# Altium project RMRC V0.1.PrjPcb (part 1 of 2)
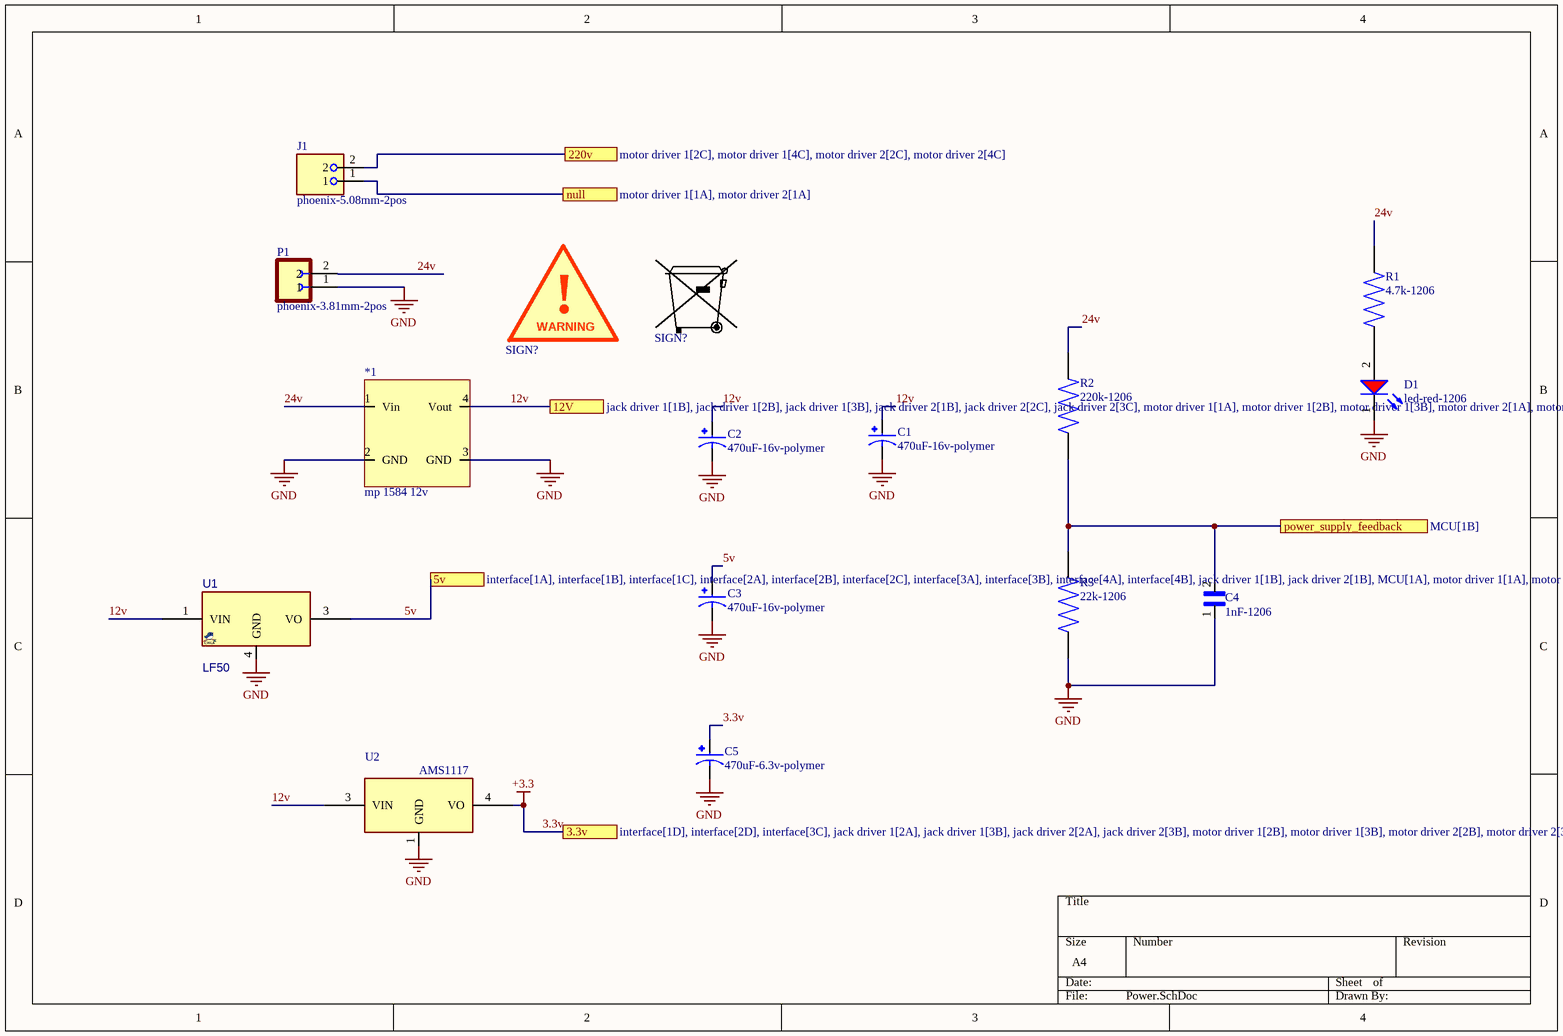
[diagram p0: Power.SchDoc]
9 sheets, 265 parts. Net scope: flat (ports and power ports of the same name join across sheets).
Board files: PCB1.PcbDoc, PCB2.PcbDoc, PCB3.PcbDoc, PCB4.PcbDoc
Sheets:
  Power.SchDoc
  MCU.SchDoc
  receiver 1.SchDoc
  receiver 2.SchDoc
  motor driver 1.SchDoc
  motor driver 2.SchDoc
  jack driver 1.SchDoc
  jack driver 2.SchDoc
  interface.SchDoc

## Sheet Power.SchDoc
size A4; SheetNumber: 1; SheetTotal: 9; SPICEModelCacheXSTPFURH: <root> / <DocumentId>XSTPFURH</DocumentId> / <CacheFrame Number="0"> / <Model Name="1206_156120rs82500" Kind="CKT"> / <Text>****** / .subckt 1206_156120RS82500  1  2 / D1 1 2 SMRW / .MODEL SMRW D / + IS=404.38E-18 / + N=2.1466 / + RS=.75545 / + IKF=193.03E-6 / + CJO=1.0000E-12 / + M=.3333 / + VJ=.75 / + BV=5 / + IBV=100.00E-6 / + TT=5.0000E-9 / .ends</Text> / </Model> / </CacheFrame> / </root>

### Parts
(Parts that share a designator on the sheet are numbered #1, #2 ... from top to bottom, then left to right.)
*1  mp 1584 12v  [PCBComponent_1]
C1  470uF-16v-polymer  [CAP_EEEFN1H101L]
C2  470uF-16v-polymer  [CAP_EEEFN1H101L]
C3  470uF-16v-polymer  [CAP_EEEFN1H101L]
C4  1nF-1206  [CAPC3216X180N]
C5  470uF-6.3v-polymer  [CAP_EEEFN1H101L]
D1  led-red-1206  [WL-SMRW_1206 dome_normal use]
J1  phoenix-5.08mm-2pos  [PHOENIX_1715721]
P1  phoenix-3.81mm-2pos  [PHOENIX_1803578]
R1  4.7k-1206  [RESC3015X65N]
R2  220k-1206  [RESC3015X65N]
R3  22k-1206  [RESC3015X65N]
SIGN?#1  Recycle-bin  [SIGN_RECBIN1]  (value not drawn)  (graphical)
SIGN?#2  WARNING  [SIGN_WARNING]  (value not drawn)  (graphical)
U1  LF50  [DPAK_3]
U2  AMS1117  [DPAK_3]  (value not drawn)

### Ports
3.3v (see interface[1D], interface[2D], interface[3C], jack driver 1[2A], jack driver 1[3B], jack driver 2[2A], jack driver 2[3B], motor driver 1[2B], motor driver 1[3B], motor driver 2[2B], motor driver 2[3B], receiver 1[2A], receiver 1[2C], receiver 1[4A], receiver 1[4C], receiver 2[2A], receiver 2[2C], receiver 2[4A], receiver 2[4C]), 5v (see interface[1A], interface[1B], interface[1C], interface[2A], interface[2B], interface[2C], interface[3A], interface[3B], interface[4A], interface[4B], jack driver 1[1B], jack driver 2[1B], MCU[1A], motor driver 1[1A], motor driver 2[1A]), 12V (see jack driver 1[1B], jack driver 1[2B], jack driver 1[3B], jack driver 2[1B], jack driver 2[2C], jack driver 2[3C], motor driver 1[1A], motor driver 1[2B], motor driver 1[3B], motor driver 2[1A], motor driver 2[2B], motor driver 2[3B]), 220v (see motor driver 1[2C], motor driver 1[4C], motor driver 2[2C], motor driver 2[4C]), null (see motor driver 1[1A], motor driver 2[1A]), power_supply_feedback (see MCU[1B])

### Nets
3.3v: C5.1 U2.4(VO) ; port 3.3v  [also labelled +3.3]
GND: *1.2(GND) *1.3(GND) C1.2 C2.2 C3.2 C4.1 C5.2 D1.1(K) P1.1 R3.1 U1.4(GND) U2.1(GND)
5v: C3.1 U1.3(VO) ; port 5v
12v: *1.4(Vout) C1.1 C2.1 U1.1(VIN) U2.3(VIN) ; port 12V
24v: *1.1(Vin) P1.2 R1.2 R2.2
NetC4_2: C4.2 R2.1 R3.2 ; port power_supply_feedback
NetD1_2: D1.2(A) R1.1
NetJ1_1: J1.1 ; port null
NetJ1_2: J1.2 ; port 220v

### Notes on the sheet
- (in symbol SIGN_WARNING) !

### Library data of the parts
*1 = Component_1
C1-C3 C5 = EEEFN1H101L: CAP ALUM 100UF 20% 50V SMD; MF: Panasonic; SnapEDA_Link: https://www.snapeda.com/parts/EEEFN1H101L/Panasonic/view-part/?ref=snap; Package: RADIAL-2 Panasonic; Value: *; MP: EEEFN1H101L; Check_prices: https://www.snapeda.com/parts/EEEFN1H101L/Panasonic/view-part/?ref=eda
C4 = CGA5L3X8R1H105M160AB: 1ÂµF Â±20% 50V Ceramic Capacitor X8R 1206 (3216 Metric); MF: TDK; Value: *; Purchase-URL: https://pricing.snapeda.com/search/part/CGA5L3X8R1H105M160AB/?ref=eda; Package: 3216 TDK; Availability: In Stock; SnapEDA_Link: https://www.snapeda.com/parts/CGA5L3X8R1H105M160AB/TDK/view-part/?ref=snap; MP: CGA5L3X8R1H105M160AB; Check_prices: https://www.snapeda.com/parts/CGA5L3X8R1H105M160AB/TDK/view-part/?ref=eda; Price: None
D1 = 156120RS82500: WL-SMRW Mono-color Reverse mount Waterclear, SMT, size 1206 dome, Red, 2V, 20°; Manufacturer: Wurth Elektronik; Chip Technology: AlInGaP; Dominant Wavelength: 624nm; Luminous Intensity: 1100mcd; Peak Wavelength: 632nm; Manufacturer Part Number: 156120RS82500; Category: Signal LEDs; Match Code: WL-SMRW; ComponentLink1Description: Website Link; ComponentLink1URL: https://www.we-online.com/redexpert/article/156120RS82500?ad; ComponentLink2Description: Datasheet Link; ComponentLink2URL: https://www.we-online.com/redexpert/spec/156120RS82500?ad; Mount: Surface Mount; Operating Temperature Max: 85°C; Operating Temperature Min: -40°C; Packaging: Tape and Reel; Case/Size Code: 1206 dome; Length: 3.2mm; Width: 1.6mm; Height: 1.85mm; Emitting Color: Red; Forward Voltage: 2V; Viewing Angle: 20°
J1 = 1715721: Package: None; Price: None; Value: *; MP: 1715721; Availability: Unavailable
P1 = 1803578: 2 Position Terminal Block Plug, Female Sockets 0.150 (3.81mm) 180Â° Free Hanging (In-Line); MF: Phoenix Contact; Price: None; Purchase-URL: https://pricing.snapeda.com/search/part/1803578/?ref=eda; Availability: Good; SnapEDA_Link: https://www.snapeda.com/parts/1803578/Phoenix%20Contact/view-part/46882/?ref=snap; MP: 1803578; Value: *; Check_prices: https://www.snapeda.com/parts/1803578/Phoenix%20Contact/view-part/46882/?ref=eda; Package: Custom Package Phoenix Contact
R1-R3 = CPF1206B10KE1: Res Thin Film 1206 10K Ohm 0.1% 1/8W Â±25ppm/Â°C Molded SMD SMD Paper T/R; Power_Rating: .125 W; MF: TE Connectivity; Voltage_Rating: 150 V; Tolerance: .1%; SnapEDA_Link: https://www.snapeda.com/parts/CPF1206B10KE1/TE+Connectivity/view-part/?ref=snap; Package: 1206; Resistance: 10K; Value: *; MP: CPF1206B10KE1; EU_RoHS_Compliance: Compliant; Check_prices: https://www.snapeda.com/parts/CPF1206B10KE1/TE+Connectivity/view-part/?ref=eda
SIGN?#1 = SIGN_RECBIN1: SIGN, Recycle-bin, 6x5mm; ASSEMBLY: DNP; VALUE: Recycle-bin
SIGN?#2 = SIGN_WARNING: SIGN, WARNING, 12X12mm; ASSEMBLY: DNP; VALUE: WARNING
U1 = VREG_LFXX_TO252: REG, Linear, LDO0.45V, 0.5A, TO-252; MANF_P#: LF33CDT; MANF: ST; PARAM: LDO0.45V, 0.5A,  82dB@120Hz; PARAM2: 1.5/1.8/2.5/3.3/5V; PRICE: 1500t; VALUE: LF50
U2 = VREG_AMS1117_DPACK3

## Sheet MCU.SchDoc
size A4; SheetNumber: 2; SheetTotal: 9
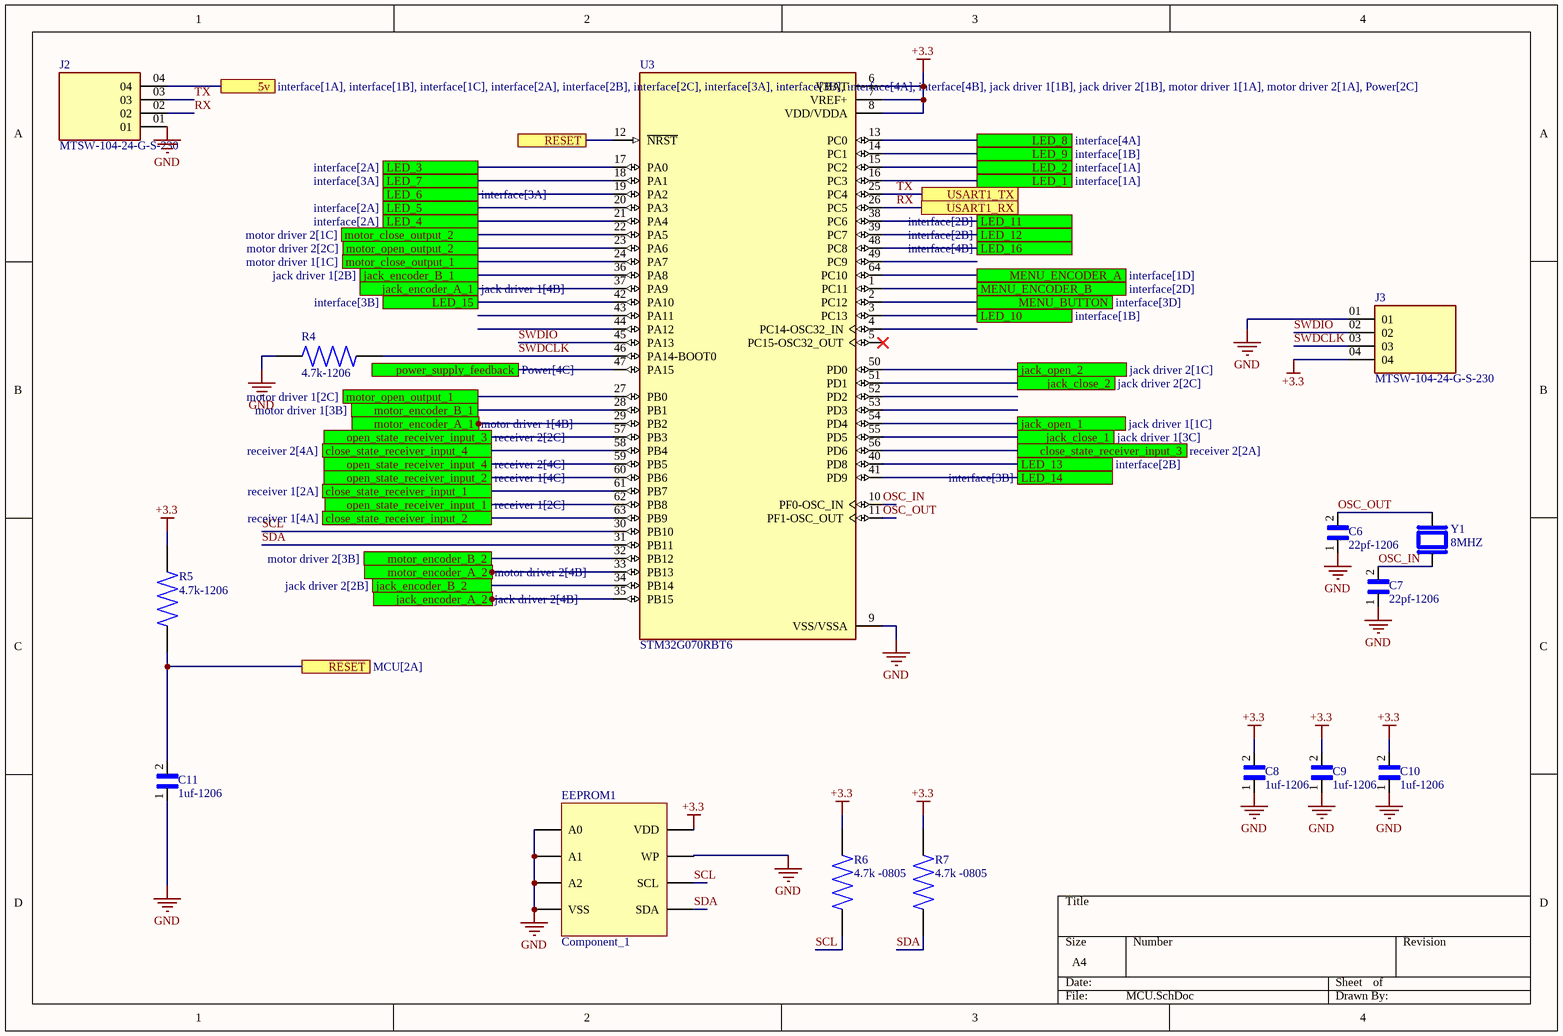
[diagram p1: MCU.SchDoc]

### Parts
C6  22pf-1206  [CAPC3216X180N]
C7  22pf-1206  [CAPC3216X180N]
C8  1uf-1206  [CAPC3216X180N]
C9  1uf-1206  [CAPC3216X180N]
C10  1uf-1206  [CAPC3216X180N]
C11  1uf-1206  [CAPC3216X180N]
EEPROM1  Component_1  [SOIC127P602X172-8N]
J2  MTSW-104-24-G-S-230  [SAMTEC_MTSW-104-24-G-S-230]
J3  MTSW-104-24-G-S-230  [SAMTEC_MTSW-104-24-G-S-230]
R4  4.7k-1206  [RESC3015X65N]
R5  4.7k-1206  [RESC3015X65N]
R6  4.7k -0805  [RESC2012X65N]
R7  4.7k -0805  [RESC2012X65N]
U3  STM32G070RBT6  [QFP50P1200X1200X160-64N]
Y1  8MHZ  [XTAL_ABLS2-12.000MHZ-D4Y-T]

### Ports
5v (see interface[1A], interface[1B], interface[1C], interface[2A], interface[2B], interface[2C], interface[3A], interface[3B], interface[4A], interface[4B], jack driver 1[1B], jack driver 2[1B], motor driver 1[1A], motor driver 2[1A], Power[2C]), close_state_receiver_input_1 (see receiver 1[2A]), close_state_receiver_input_2 (see receiver 1[4A]), close_state_receiver_input_3 (see receiver 2[2A]), close_state_receiver_input_4 (see receiver 2[4A]), jack_close_1 (see jack driver 1[3C]), jack_close_2 (see jack driver 2[2C]), jack_encoder_A_1 (see jack driver 1[4B]), jack_encoder_A_2 (see jack driver 2[4B]), jack_encoder_B_1 (see jack driver 1[2B]), jack_encoder_B_2 (see jack driver 2[2B]), jack_open_1 (see jack driver 1[1C]), jack_open_2 (see jack driver 2[1C]), LED_1 (see interface[1A]), LED_2 (see interface[1A]), LED_3 (see interface[2A]), LED_4 (see interface[2A]), LED_5 (see interface[2A]), LED_6 (see interface[3A]), LED_7 (see interface[3A]), LED_8 (see interface[4A]), LED_9 (see interface[1B]), LED_10 (see interface[1B]), LED_11 (see interface[2B]), LED_12 (see interface[2B]), LED_13 (see interface[2B]), LED_14 (see interface[3B]), LED_15 (see interface[3B]), LED_16 (see interface[4B]), MENU_BUTTON (see interface[3D]), MENU_ENCODER_A (see interface[1D]), MENU_ENCODER_B (see interface[2D]), motor_close_output_1 (see motor driver 1[1C]), motor_close_output_2 (see motor driver 2[1C]), motor_encoder_A_1 (see motor driver 1[4B]), motor_encoder_A_2 (see motor driver 2[4B]), motor_encoder_B_1 (see motor driver 1[3B]), motor_encoder_B_2 (see motor driver 2[3B]), motor_open_output_1 (see motor driver 1[2C]), motor_open_output_2 (see motor driver 2[2C]), open_state_receiver_input_1 (see receiver 1[2C]), open_state_receiver_input_2 (see receiver 1[4C]), open_state_receiver_input_3 (see receiver 2[2C]), open_state_receiver_input_4 (see receiver 2[4C]), power_supply_feedback (see Power[4C]), RESET (see MCU[1C]), RESET (see MCU[2A]), USART1_RX, USART1_TX

### Nets
+3.3: C8.2 C9.2 C10.2 EEPROM1.7(VDD) J3.04 R5.2 R6.2 R7.2 U3.6(VBAT) U3.7(VREF+) U3.8(VDD/VDDA)  [project net 3.3v]
GND: C6.1 C7.1 C8.1 C9.1 C10.1 C11.1 EEPROM1.0(A0) EEPROM1.1(A1) EEPROM1.2(A2) EEPROM1.3(VSS) EEPROM1.6(WP) J2.01 J3.01 R4.2 U3.9(VSS/VSSA)
5v: J2.04 ; port 5v
OSC_IN: C7.2 U3.10(PF0-OSC_IN) Y1.1
OSC_OUT: C6.2 U3.11(PF1-OSC_OUT) Y1.2
RX: J2.02 U3.26(PC5) ; port USART1_RX
SCL: EEPROM1.5(SCL) R6.1 U3.30(PB10)
SDA: EEPROM1.4(SDA) R7.1 U3.31(PB11)
SWDCLK: J3.03 R4.1 U3.46(PA14-BOOT0)
SWDIO: J3.02 U3.45(PA13)
TX: J2.03 U3.25(PC4) ; port USART1_TX
NetC4_2: U3.47(PA15) ; port power_supply_feedback
NetC11_2: C11.2 R5.1 U3.12(~{NRST}) ; port RESET
NetC12_2: U3.37(PA9) ; port jack_encoder_A_1
NetC14_2: U3.29(PB2) ; port motor_encoder_A_1
NetC15_2: U3.2(PC12) ; port MENU_BUTTON
NetC16_2: U3.64(PC10) ; port MENU_ENCODER_A
NetC17_2: U3.61(PB7) ; port close_state_receiver_input_1
NetC18_2: U3.63(PB9) ; port close_state_receiver_input_2
NetC19_2: U3.62(PB8) ; port open_state_receiver_input_1
NetC20_2: U3.60(PB6) ; port open_state_receiver_input_2
NetC21_2: U3.56(PD6) ; port close_state_receiver_input_3
NetC22_2: U3.58(PB4) ; port close_state_receiver_input_4
NetC23_2: U3.57(PB3) ; port open_state_receiver_input_3
NetC24_2: U3.59(PB5) ; port open_state_receiver_input_4
NetC25_2: U3.35(PB15) ; port jack_encoder_A_2
NetC27_2: U3.33(PB13) ; port motor_encoder_A_2
NetQ1_2: U3.36(PA8) ; port jack_encoder_B_1
NetQ5_2: U3.28(PB1) ; port motor_encoder_B_1
NetQ26_2: U3.1(PC11) ; port MENU_ENCODER_B
NetQ27_2: U3.34(PB14) ; port jack_encoder_B_2
NetQ31_2: U3.32(PB12) ; port motor_encoder_B_2
NetR12_2: U3.54(PD4) ; port jack_open_1
NetR13_2: U3.55(PD5) ; port jack_close_1
NetR18_2: U3.24(PA7) ; port motor_close_output_1
NetR19_2: U3.27(PB0) ; port motor_open_output_1
NetR28_2: U3.16(PC3) ; port LED_1
NetR29_2: U3.15(PC2) ; port LED_2
NetR30_2: U3.17(PA0) ; port LED_3
NetR31_2: U3.21(PA4) ; port LED_4
NetR32_2: U3.20(PA3) ; port LED_5
NetR33_2: U3.19(PA2) ; port LED_6
NetR34_2: U3.18(PA1) ; port LED_7
NetR35_2: U3.13(PC0) ; port LED_8
NetR44_2: U3.14(PC1) ; port LED_9
NetR45_2: U3.3(PC13) ; port LED_10
NetR46_2: U3.38(PC6) ; port LED_11
NetR47_2: U3.39(PC7) ; port LED_12
NetR48_2: U3.40(PD8) ; port LED_13
NetR49_2: U3.41(PD9) ; port LED_14
NetR50_2: U3.42(PA10) ; port LED_15
NetR51_2: U3.48(PC8) ; port LED_16
NetR109_2: U3.50(PD0) ; port jack_open_2
NetR110_2: U3.51(PD1) ; port jack_close_2
NetR115_2: U3.22(PA5) ; port motor_close_output_2
NetR116_2: U3.23(PA6) ; port motor_open_output_2

Not connected (* = marked no-connect by the designer): U3 4(PC14-OSC32_IN) 5(PC15-OSC32_OUT)* 43(PA11) 44(PA12) 49(PC9) 52(PD2) 53(PD3)

### Library data of the parts
C6-C11 = CGA5L3X8R1H105M160AB: as C4 on sheet Power; Value: *; Purchase-URL: https://pricing.snapeda.com/search/part/CGA5L3X8R1H105M160AB/?ref=eda; Package: 3216 TDK; Availability: In Stock; SnapEDA_Link: https://www.snapeda.com/parts/CGA5L3X8R1H105M160AB/TDK/view-part/?ref=snap; MP: CGA5L3X8R1H105M160AB; Check_prices: https://www.snapeda.com/parts/CGA5L3X8R1H105M160AB/TDK/view-part/?ref=eda; Price: None
R4 R5 = CPF1206B10KE1: as R1 on sheet Power; SnapEDA_Link: https://www.snapeda.com/parts/CPF1206B10KE1/TE+Connectivity/view-part/?ref=snap; Package: 1206; Resistance: 10K; Value: *; MP: CPF1206B10KE1; EU_RoHS_Compliance: Compliant; Check_prices: https://www.snapeda.com/parts/CPF1206B10KE1/TE+Connectivity/view-part/?ref=eda
R6 R7 = CRGCQ0805J470R: Fixed Resistor CRGCQ 0805 470R 5%; MF: TE Connectivity; SnapEDA_Link: https://www.snapeda.com/parts/CRGCQ0805J470R/TE+Connectivity/view-part/?ref=snap; Package: 2012 TE Connectivity; Value: *; MP: CRGCQ0805J470R; Check_prices: https://www.snapeda.com/parts/CRGCQ0805J470R/TE+Connectivity/view-part/?ref=eda
U3 = STM32G070RBT6: ARMÂ® CortexÂ®-M0+ STM32G0 Microcontroller IC 32-Bit Single-Core 64MHz 128KB (128K x 8) FLASH 64-LQFP (10x10); MF: STMicroelectronics; SnapEDA_Link: https://www.snapeda.com/parts/STM32G070RBT6/STMicroelectronics/view-part/?ref=snap; Package: LQFP-64 STMicroelectronics; Value: *; MP: STM32G070RBT6; Check_prices: https://www.snapeda.com/parts/STM32G070RBT6/STMicroelectronics/view-part/?ref=eda
Y1 = ABLS2-12.000MHZ-D4Y-T: HC/49US (AT49) LOW PROFILE SURFACE MOUNT MICROPROCESSOR CRYSTAL; MF: Abracon; Purchase-URL: https://pricing.snapeda.com/search/part/ABLS2-12.000MHZ-D4Y-T/?ref=eda; Package: HC49/US Abracon; MP: ABLS2-12.000MHZ-D4Y-T; Value: *; Price: None; Availability: In Stock; SnapEDA_Link: https://www.snapeda.com/parts/ABLS2-12.000MHZ-D4Y-T/Abracon+LLC/view-part/?ref=snap; Check_prices: https://www.snapeda.com/parts/ABLS2-12.000MHZ-D4Y-T/Abracon+LLC/view-part/?ref=eda
J2 J3 = MTSW-104-24-G-S-230: Price: None; Value: *; Package: None; Availability: Unavailable; MP: MTSW-104-24-G-S-230

## Sheet receiver 1.SchDoc
size A4; SheetNumber: 3; SheetTotal: 9; SPICEModelCacheALZHYQGP: <root> / <DocumentId>ALZHYQGP</DocumentId> / <CacheFrame Number="0"> / <Model Name="1206_156120rs82500" Kind="CKT"> / <Text>****** / .subckt 1206_156120RS82500  1  2 / D1 1 2 SMRW / .MODEL SMRW D / + IS=404.38E-18 / + N=2.1466 / + RS=.75545 / + IKF=193.03E-6 / + CJO=1.0000E-12 / + M=.3333 / + VJ=.75 / + BV=5 / + IBV=100.00E-6 / + TT=5.0000E-9 / .ends</Text> / </Model> / </CacheFrame> / </root>
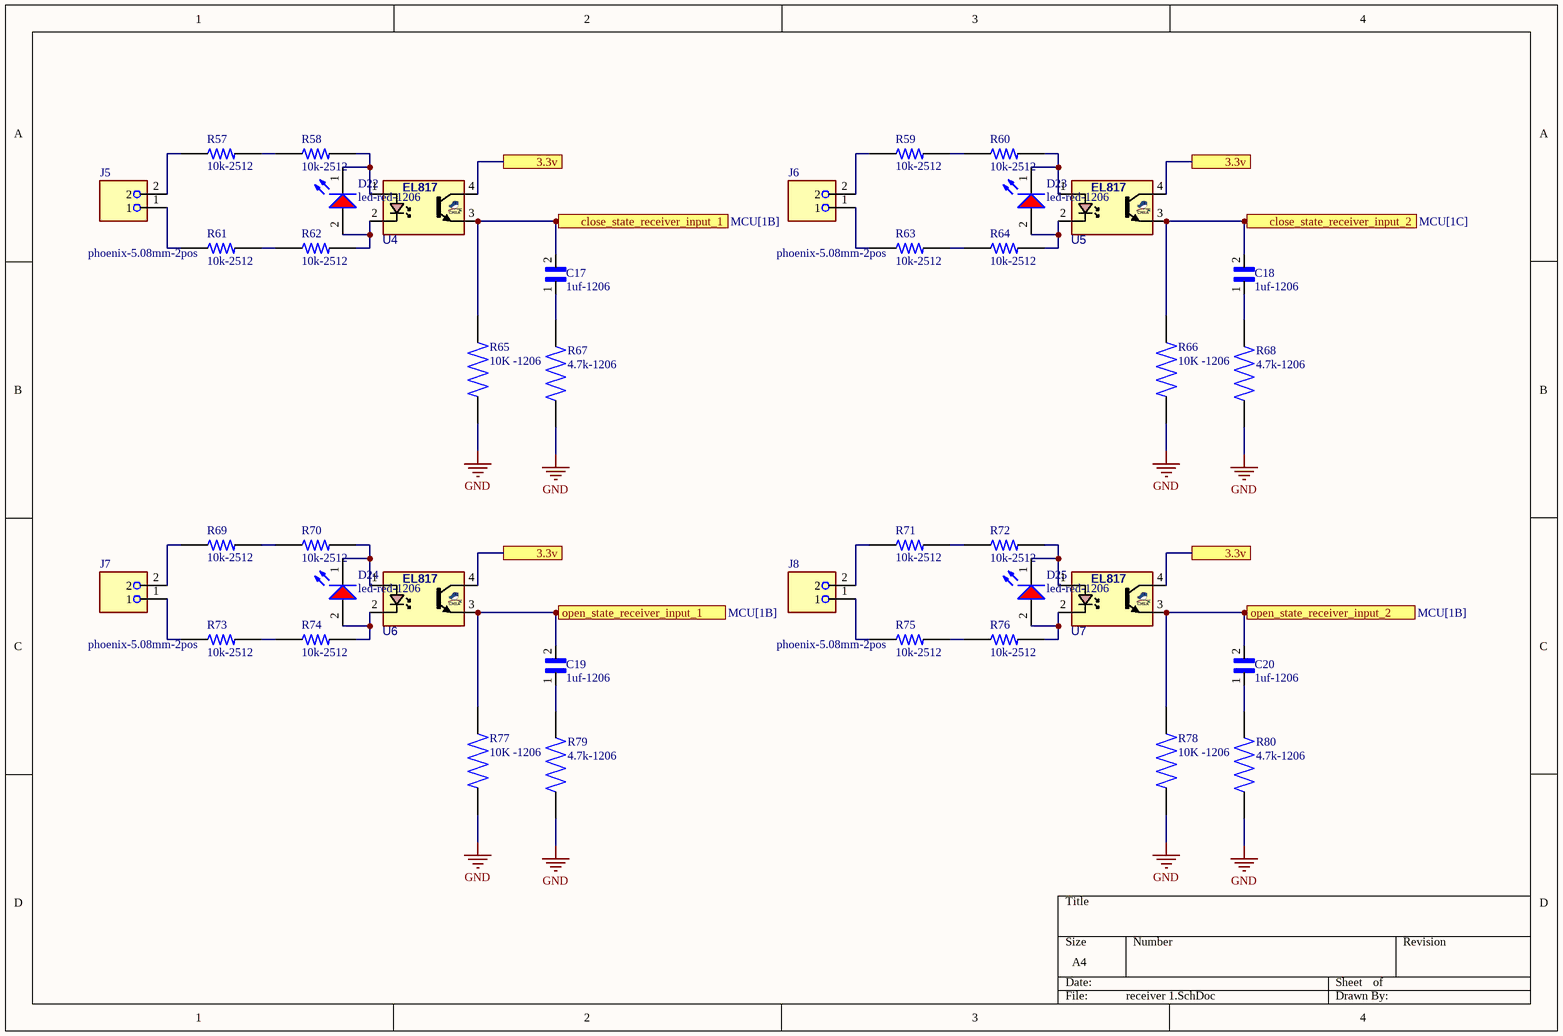
[diagram p2: receiver 1.SchDoc]

### Parts
C17  1uf-1206  [CAPC3216X180N]
C18  1uf-1206  [CAPC3216X180N]
C19  1uf-1206  [CAPC3216X180N]
C20  1uf-1206  [CAPC3216X180N]
D22  led-red-1206  [WL-SMRW_1206 dome_normal use]
D23  led-red-1206  [WL-SMRW_1206 dome_normal use]
D24  led-red-1206  [WL-SMRW_1206 dome_normal use]
D25  led-red-1206  [WL-SMRW_1206 dome_normal use]
J5  phoenix-5.08mm-2pos  [PHOENIX_1715721]
J6  phoenix-5.08mm-2pos  [PHOENIX_1715721]
J7  phoenix-5.08mm-2pos  [PHOENIX_1715721]
J8  phoenix-5.08mm-2pos  [PHOENIX_1715721]
R57  10k-2512  [RESC6331X70N]
R58  10k-2512  [RESC6331X70N]
R59  10k-2512  [RESC6331X70N]
R60  10k-2512  [RESC6331X70N]
R61  10k-2512  [RESC6331X70N]
R62  10k-2512  [RESC6331X70N]
R63  10k-2512  [RESC6331X70N]
R64  10k-2512  [RESC6331X70N]
R65  10K -1206  [RESC3015X65N]
R66  10K -1206  [RESC3015X65N]
R67  4.7k-1206  [RESC3015X65N]
R68  4.7k-1206  [RESC3015X65N]
R69  10k-2512  [RESC6331X70N]
R70  10k-2512  [RESC6331X70N]
R71  10k-2512  [RESC6331X70N]
R72  10k-2512  [RESC6331X70N]
R73  10k-2512  [RESC6331X70N]
R74  10k-2512  [RESC6331X70N]
R75  10k-2512  [RESC6331X70N]
R76  10k-2512  [RESC6331X70N]
R77  10K -1206  [RESC3015X65N]
R78  10K -1206  [RESC3015X65N]
R79  4.7k-1206  [RESC3015X65N]
R80  4.7k-1206  [RESC3015X65N]
U4  EL817  [DIP_4SMD]  (value not drawn)
U5  EL817  [DIP_4SMD]  (value not drawn)
U6  EL817  [DIP_4SMD]  (value not drawn)
U7  EL817  [DIP_4SMD]  (value not drawn)

### Ports
3.3v (see interface[1D], interface[2D], interface[3C], jack driver 1[2A], jack driver 1[3B], jack driver 2[2A], jack driver 2[3B], motor driver 1[2B], motor driver 1[3B], motor driver 2[2B], motor driver 2[3B], Power[2D], receiver 1[2A], receiver 1[2C], receiver 1[4A], receiver 2[2A], receiver 2[2C], receiver 2[4A], receiver 2[4C]), 3.3v (see interface[1D], interface[2D], interface[3C], jack driver 1[2A], jack driver 1[3B], jack driver 2[2A], jack driver 2[3B], motor driver 1[2B], motor driver 1[3B], motor driver 2[2B], motor driver 2[3B], Power[2D], receiver 1[2A], receiver 1[2C], receiver 1[4C], receiver 2[2A], receiver 2[2C], receiver 2[4A], receiver 2[4C]), 3.3v (see interface[1D], interface[2D], interface[3C], jack driver 1[2A], jack driver 1[3B], jack driver 2[2A], jack driver 2[3B], motor driver 1[2B], motor driver 1[3B], motor driver 2[2B], motor driver 2[3B], Power[2D], receiver 1[2A], receiver 1[4A], receiver 1[4C], receiver 2[2A], receiver 2[2C], receiver 2[4A], receiver 2[4C]), 3.3v (see interface[1D], interface[2D], interface[3C], jack driver 1[2A], jack driver 1[3B], jack driver 2[2A], jack driver 2[3B], motor driver 1[2B], motor driver 1[3B], motor driver 2[2B], motor driver 2[3B], Power[2D], receiver 1[2C], receiver 1[4A], receiver 1[4C], receiver 2[2A], receiver 2[2C], receiver 2[4A], receiver 2[4C]), close_state_receiver_input_1 (see MCU[1B]), close_state_receiver_input_2 (see MCU[1C]), open_state_receiver_input_1 (see MCU[1B]), open_state_receiver_input_2 (see MCU[1B])

### Nets
3.3v: U4.4(C) U5.4(C) U6.4(C) U7.4(C) ; port 3.3v
GND: R65.1 R66.1 R67.1 R68.1 R77.1 R78.1 R79.1 R80.1
NetC17_1: C17.1 R67.2
NetC17_2: C17.2 R65.2 U4.3(E) ; port close_state_receiver_input_1
NetC18_1: C18.1 R68.2
NetC18_2: C18.2 R66.2 U5.3(E) ; port close_state_receiver_input_2
NetC19_1: C19.1 R79.2
NetC19_2: C19.2 R77.2 U6.3(E) ; port open_state_receiver_input_1
NetC20_1: C20.1 R80.2
NetC20_2: C20.2 R78.2 U7.3(E) ; port open_state_receiver_input_2
NetD22_1: D22.1(K) R58.2 U4.1(A)
NetD22_2: D22.2(A) R62.2 U4.2(K)
NetD23_1: D23.1(K) R60.2 U5.1(A)
NetD23_2: D23.2(A) R64.2 U5.2(K)
NetD24_1: D24.1(K) R70.2 U6.1(A)
NetD24_2: D24.2(A) R74.2 U6.2(K)
NetD25_1: D25.1(K) R72.2 U7.1(A)
NetD25_2: D25.2(A) R76.2 U7.2(K)
NetJ5_1: J5.1 R61.1
NetJ5_2: J5.2 R57.1
NetJ6_1: J6.1 R63.1
NetJ6_2: J6.2 R59.1
NetJ7_1: J7.1 R73.1
NetJ7_2: J7.2 R69.1
NetJ8_1: J8.1 R75.1
NetJ8_2: J8.2 R71.1
NetR57_2: R57.2 R58.1
NetR59_2: R59.2 R60.1
NetR61_2: R61.2 R62.1
NetR63_2: R63.2 R64.1
NetR69_2: R69.2 R70.1
NetR71_2: R71.2 R72.1
NetR73_2: R73.2 R74.1
NetR75_2: R75.2 R76.1

### Library data of the parts
C17-C20 = CGA5L3X8R1H105M160AB: as C4 on sheet Power; Value: *; Purchase-URL: https://pricing.snapeda.com/search/part/CGA5L3X8R1H105M160AB/?ref=eda; Package: 3216 TDK; Availability: In Stock; SnapEDA_Link: https://www.snapeda.com/parts/CGA5L3X8R1H105M160AB/TDK/view-part/?ref=snap; MP: CGA5L3X8R1H105M160AB; Check_prices: https://www.snapeda.com/parts/CGA5L3X8R1H105M160AB/TDK/view-part/?ref=eda; Price: None
D22-D25 = 156120RS82500: as D1 on sheet Power; Manufacturer Part Number: 156120RS82500; Category: Signal LEDs; Match Code: WL-SMRW; ComponentLink1Description: Website Link; ComponentLink1URL: https://www.we-online.com/redexpert/article/156120RS82500?ad; ComponentLink2Description: Datasheet Link; ComponentLink2URL: https://www.we-online.com/redexpert/spec/156120RS82500?ad; Mount: Surface Mount; Operating Temperature Max: 85°C; Operating Temperature Min: -40°C; Packaging: Tape and Reel; Case/Size Code: 1206 dome; Length: 3.2mm; Width: 1.6mm; Height: 1.85mm; Emitting Color: Red; Forward Voltage: 2V; Viewing Angle: 20°
J5-J8 = 1715721: Package: None; Price: None; Value: *; MP: 1715721; Availability: Unavailable
R57-R64 R69-R76 = 5-2176246-2: 18 kOhms Â±5% 1.5W Chip Resistor 2512 (6432 Metric) Pulse Withstanding Thick Film; MF: TE Connectivity; SnapEDA_Link: https://www.snapeda.com/parts/5-2176246-2/TE+Connectivity+AMP+Connectors/view-part/?ref=snap; Package: None; Value: *; MP: 5-2176246-2; Check_prices: https://www.snapeda.com/parts/5-2176246-2/TE+Connectivity+AMP+Connectors/view-part/?ref=eda
R65-R68 R77-R80 = CPF1206B10KE1: as R1 on sheet Power; SnapEDA_Link: https://www.snapeda.com/parts/CPF1206B10KE1/TE+Connectivity/view-part/?ref=snap; Package: 1206; Resistance: 10K; Value: *; MP: CPF1206B10KE1; EU_RoHS_Compliance: Compliant; Check_prices: https://www.snapeda.com/parts/CPF1206B10KE1/TE+Connectivity/view-part/?ref=eda
U4-U7 = OPTC_TR4P_EL817_SMD: OPTOCOUPLER, TRANSISTOR, 4PIN; PARAM: IF=5mA; PARAM2: VCE = 5V; PRICE: 300t@Paya; VALUE: EL817; PACKAGE: DIP-4SMD

## Sheet receiver 2.SchDoc
size A4; SheetNumber: 4; SheetTotal: 9
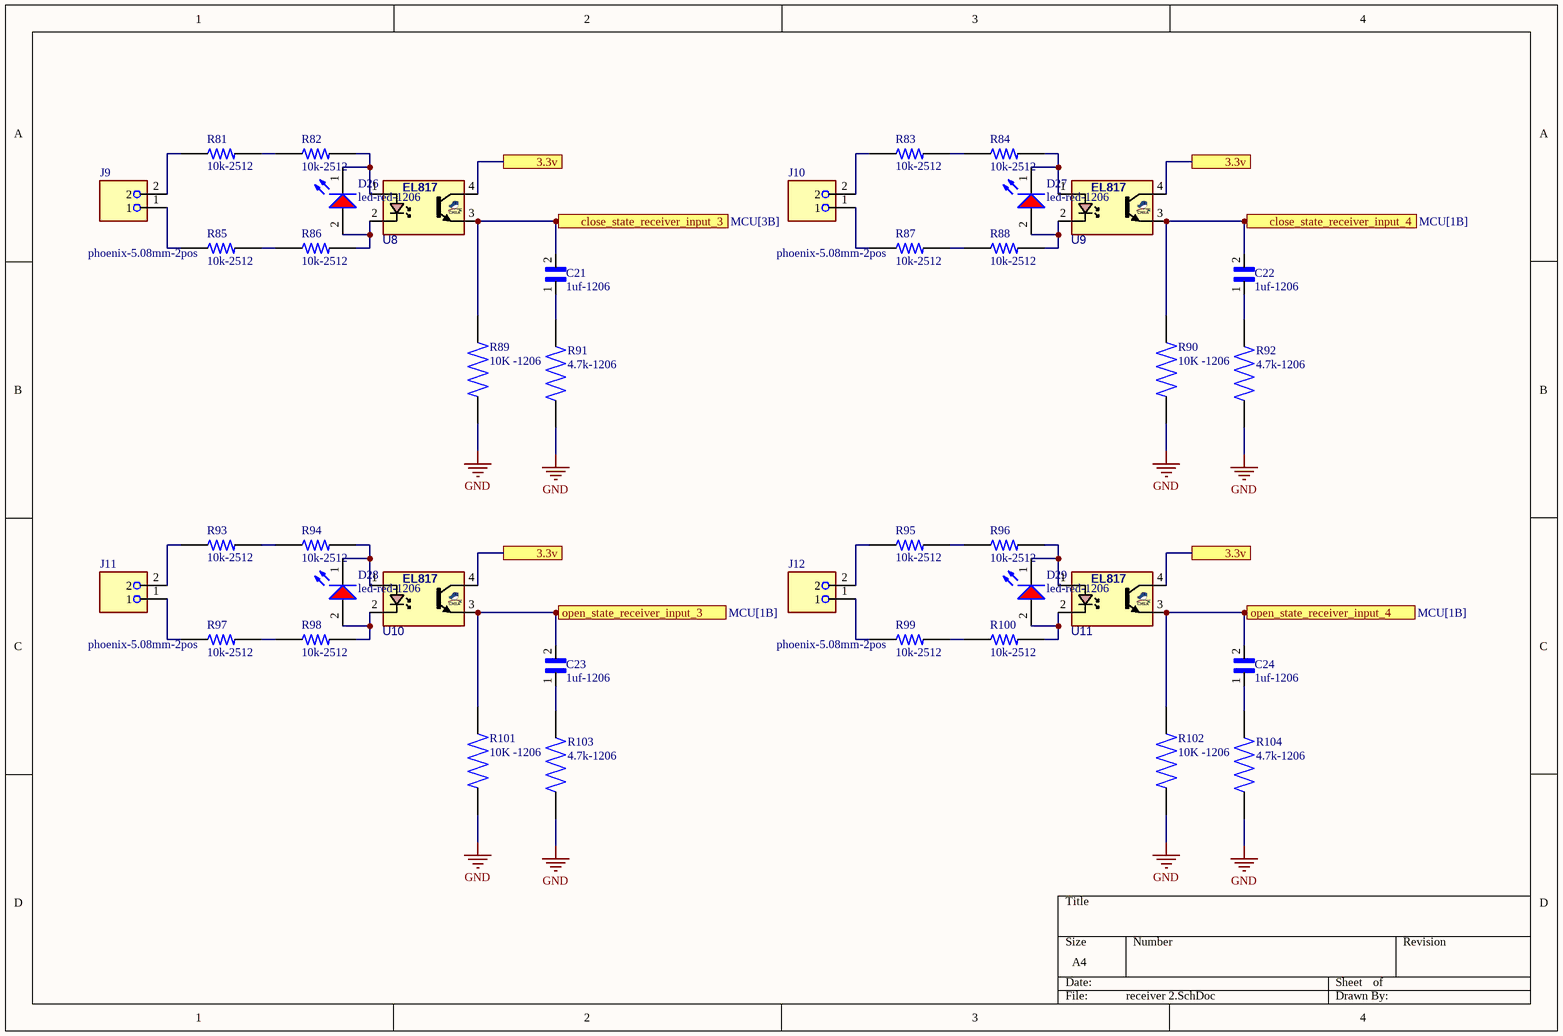
[diagram p3: receiver 2.SchDoc]

### Parts
C21  1uf-1206  [CAPC3216X180N]
C22  1uf-1206  [CAPC3216X180N]
C23  1uf-1206  [CAPC3216X180N]
C24  1uf-1206  [CAPC3216X180N]
D26  led-red-1206  [WL-SMRW_1206 dome_normal use]
D27  led-red-1206  [WL-SMRW_1206 dome_normal use]
D28  led-red-1206  [WL-SMRW_1206 dome_normal use]
D29  led-red-1206  [WL-SMRW_1206 dome_normal use]
J9  phoenix-5.08mm-2pos  [PHOENIX_1715721]
J10  phoenix-5.08mm-2pos  [PHOENIX_1715721]
J11  phoenix-5.08mm-2pos  [PHOENIX_1715721]
J12  phoenix-5.08mm-2pos  [PHOENIX_1715721]
R81  10k-2512  [RESC6331X70N]
R82  10k-2512  [RESC6331X70N]
R83  10k-2512  [RESC6331X70N]
R84  10k-2512  [RESC6331X70N]
R85  10k-2512  [RESC6331X70N]
R86  10k-2512  [RESC6331X70N]
R87  10k-2512  [RESC6331X70N]
R88  10k-2512  [RESC6331X70N]
R89  10K -1206  [RESC3015X65N]
R90  10K -1206  [RESC3015X65N]
R91  4.7k-1206  [RESC3015X65N]
R92  4.7k-1206  [RESC3015X65N]
R93  10k-2512  [RESC6331X70N]
R94  10k-2512  [RESC6331X70N]
R95  10k-2512  [RESC6331X70N]
R96  10k-2512  [RESC6331X70N]
R97  10k-2512  [RESC6331X70N]
R98  10k-2512  [RESC6331X70N]
R99  10k-2512  [RESC6331X70N]
R100  10k-2512  [RESC6331X70N]
R101  10K -1206  [RESC3015X65N]
R102  10K -1206  [RESC3015X65N]
R103  4.7k-1206  [RESC3015X65N]
R104  4.7k-1206  [RESC3015X65N]
U8  EL817  [DIP_4SMD]  (value not drawn)
U9  EL817  [DIP_4SMD]  (value not drawn)
U10  EL817  [DIP_4SMD]  (value not drawn)
U11  EL817  [DIP_4SMD]  (value not drawn)

### Ports
3.3v (see interface[1D], interface[2D], interface[3C], jack driver 1[2A], jack driver 1[3B], jack driver 2[2A], jack driver 2[3B], motor driver 1[2B], motor driver 1[3B], motor driver 2[2B], motor driver 2[3B], Power[2D], receiver 1[2A], receiver 1[2C], receiver 1[4A], receiver 1[4C], receiver 2[2A], receiver 2[2C], receiver 2[4A]), 3.3v (see interface[1D], interface[2D], interface[3C], jack driver 1[2A], jack driver 1[3B], jack driver 2[2A], jack driver 2[3B], motor driver 1[2B], motor driver 1[3B], motor driver 2[2B], motor driver 2[3B], Power[2D], receiver 1[2A], receiver 1[2C], receiver 1[4A], receiver 1[4C], receiver 2[2A], receiver 2[2C], receiver 2[4C]), 3.3v (see interface[1D], interface[2D], interface[3C], jack driver 1[2A], jack driver 1[3B], jack driver 2[2A], jack driver 2[3B], motor driver 1[2B], motor driver 1[3B], motor driver 2[2B], motor driver 2[3B], Power[2D], receiver 1[2A], receiver 1[2C], receiver 1[4A], receiver 1[4C], receiver 2[2A], receiver 2[4A], receiver 2[4C]), 3.3v (see interface[1D], interface[2D], interface[3C], jack driver 1[2A], jack driver 1[3B], jack driver 2[2A], jack driver 2[3B], motor driver 1[2B], motor driver 1[3B], motor driver 2[2B], motor driver 2[3B], Power[2D], receiver 1[2A], receiver 1[2C], receiver 1[4A], receiver 1[4C], receiver 2[2C], receiver 2[4A], receiver 2[4C]), close_state_receiver_input_3 (see MCU[3B]), close_state_receiver_input_4 (see MCU[1B]), open_state_receiver_input_3 (see MCU[1B]), open_state_receiver_input_4 (see MCU[1B])

### Nets
3.3v: U8.4(C) U9.4(C) U10.4(C) U11.4(C) ; port 3.3v
GND: R89.1 R90.1 R91.1 R92.1 R101.1 R102.1 R103.1 R104.1
NetC21_1: C21.1 R91.2
NetC21_2: C21.2 R89.2 U8.3(E) ; port close_state_receiver_input_3
NetC22_1: C22.1 R92.2
NetC22_2: C22.2 R90.2 U9.3(E) ; port close_state_receiver_input_4
NetC23_1: C23.1 R103.2
NetC23_2: C23.2 R101.2 U10.3(E) ; port open_state_receiver_input_3
NetC24_1: C24.1 R104.2
NetC24_2: C24.2 R102.2 U11.3(E) ; port open_state_receiver_input_4
NetD26_1: D26.1(K) R82.2 U8.1(A)
NetD26_2: D26.2(A) R86.2 U8.2(K)
NetD27_1: D27.1(K) R84.2 U9.1(A)
NetD27_2: D27.2(A) R88.2 U9.2(K)
NetD28_1: D28.1(K) R94.2 U10.1(A)
NetD28_2: D28.2(A) R98.2 U10.2(K)
NetD29_1: D29.1(K) R96.2 U11.1(A)
NetD29_2: D29.2(A) R100.2 U11.2(K)
NetJ9_1: J9.1 R85.1
NetJ9_2: J9.2 R81.1
NetJ10_1: J10.1 R87.1
NetJ10_2: J10.2 R83.1
NetJ11_1: J11.1 R97.1
NetJ11_2: J11.2 R93.1
NetJ12_1: J12.1 R99.1
NetJ12_2: J12.2 R95.1
NetR81_2: R81.2 R82.1
NetR83_2: R83.2 R84.1
NetR85_2: R85.2 R86.1
NetR87_2: R87.2 R88.1
NetR93_2: R93.2 R94.1
NetR95_2: R95.2 R96.1
NetR97_2: R97.2 R98.1
NetR99_2: R99.2 R100.1

### Library data of the parts
C21-C24 = CGA5L3X8R1H105M160AB: as C4 on sheet Power; Value: *; Purchase-URL: https://pricing.snapeda.com/search/part/CGA5L3X8R1H105M160AB/?ref=eda; Package: 3216 TDK; Availability: In Stock; SnapEDA_Link: https://www.snapeda.com/parts/CGA5L3X8R1H105M160AB/TDK/view-part/?ref=snap; MP: CGA5L3X8R1H105M160AB; Check_prices: https://www.snapeda.com/parts/CGA5L3X8R1H105M160AB/TDK/view-part/?ref=eda; Price: None
D26-D29 = 156120RS82500: as D1 on sheet Power; Manufacturer Part Number: 156120RS82500; Category: Signal LEDs; Match Code: WL-SMRW; ComponentLink1Description: Website Link; ComponentLink1URL: https://www.we-online.com/redexpert/article/156120RS82500?ad; ComponentLink2Description: Datasheet Link; ComponentLink2URL: https://www.we-online.com/redexpert/spec/156120RS82500?ad; Mount: Surface Mount; Operating Temperature Max: 85°C; Operating Temperature Min: -40°C; Packaging: Tape and Reel; Case/Size Code: 1206 dome; Length: 3.2mm; Width: 1.6mm; Height: 1.85mm; Emitting Color: Red; Forward Voltage: 2V; Viewing Angle: 20°
J9-J12 = 1715721: Package: None; Price: None; Value: *; MP: 1715721; Availability: Unavailable
R81-R88 R93-R100 = 5-2176246-2: as R57 on sheet receiver 1; SnapEDA_Link: https://www.snapeda.com/parts/5-2176246-2/TE+Connectivity+AMP+Connectors/view-part/?ref=snap; Package: None; Value: *; MP: 5-2176246-2; Check_prices: https://www.snapeda.com/parts/5-2176246-2/TE+Connectivity+AMP+Connectors/view-part/?ref=eda
R89-R92 R101-R104 = CPF1206B10KE1: as R1 on sheet Power; SnapEDA_Link: https://www.snapeda.com/parts/CPF1206B10KE1/TE+Connectivity/view-part/?ref=snap; Package: 1206; Resistance: 10K; Value: *; MP: CPF1206B10KE1; EU_RoHS_Compliance: Compliant; Check_prices: https://www.snapeda.com/parts/CPF1206B10KE1/TE+Connectivity/view-part/?ref=eda
U8-U11 = OPTC_TR4P_EL817_SMD: as U4 on sheet receiver 1; PRICE: 300t@Paya; VALUE: EL817; PACKAGE: DIP-4SMD

## Sheet motor driver 1.SchDoc
size A4; SheetNumber: 5; SheetTotal: 9
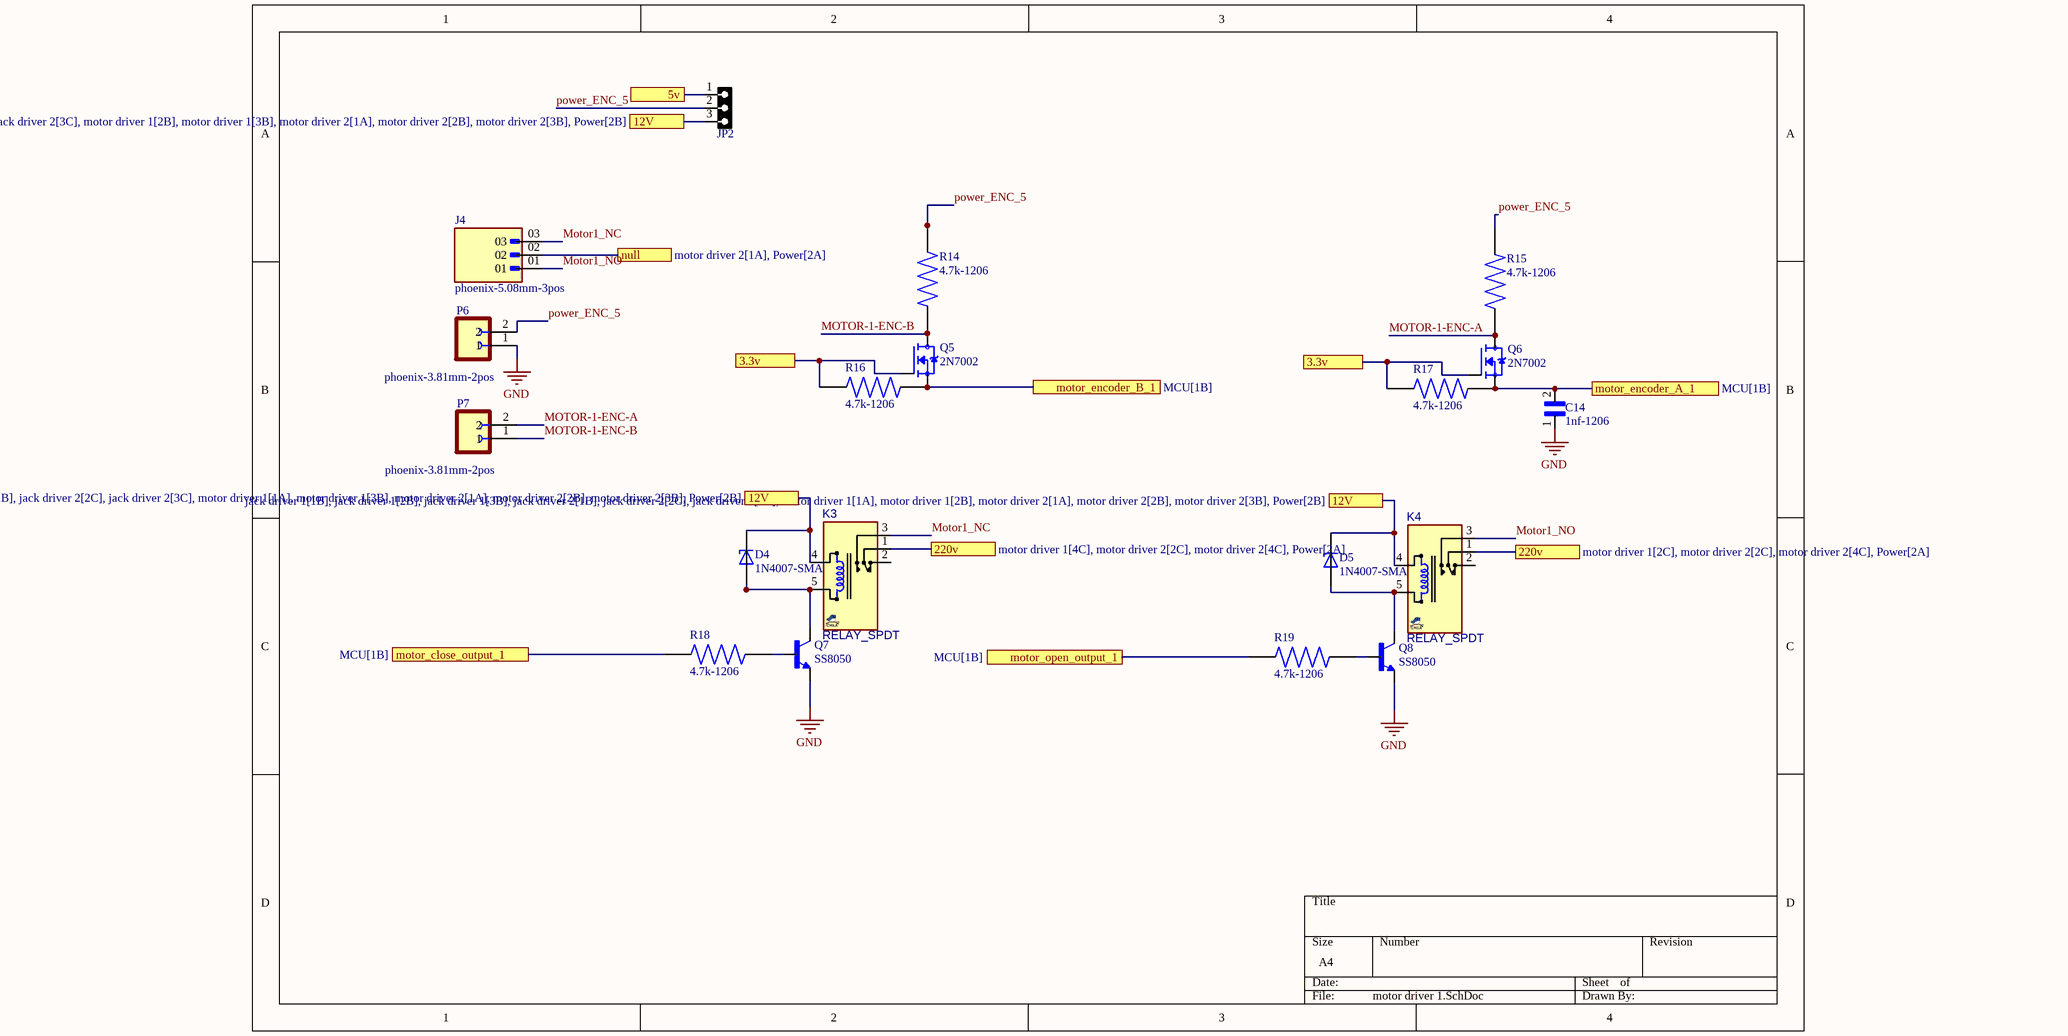
[diagram p4: motor driver 1.SchDoc]

### Parts
C14  1nf-1206  [CAPC3216X180N]
D4  1N4007-SMA  [DIOM4325X250N]
D5  1N4007-SMA  [DIOM4325X250N]
J4  phoenix-5.08mm-3pos  [PHOENIX_1759020]
JP2  HDRF3  [HDRLP_F_1X3]  (value not drawn)
K3  RELAY_SPDT  [REL_SPDT_5_1512]
K4  RELAY_SPDT  [REL_SPDT_5_1512]
P6  phoenix-3.81mm-2pos  [PHOENIX_1803578]
P7  phoenix-3.81mm-2pos  [PHOENIX_1803578]
Q5  2N7002  [SOT95P240X111-3N]
Q6  2N7002  [SOT95P240X111-3N]
Q7  SS8050  [TRANS_SS8050-G]
Q8  SS8050  [TRANS_SS8050-G]
R14  4.7k-1206  [RESC3015X65N]
R15  4.7k-1206  [RESC3015X65N]
R16  4.7k-1206  [RESC3015X65N]
R17  4.7k-1206  [RESC3015X65N]
R18  4.7k-1206  [RESC3015X65N]
R19  4.7k-1206  [RESC3015X65N]

### Ports
3.3v (see interface[0D], interface[1D], interface[3C], jack driver 1[2A], jack driver 1[3B], jack driver 2[2A], jack driver 2[3B], motor driver 1[2B], motor driver 2[2B], motor driver 2[3B], Power[2D], receiver 1[2A], receiver 1[2C], receiver 1[4A], receiver 1[4C], receiver 2[2A], receiver 2[2C], receiver 2[4A], receiver 2[4C]), 3.3v (see interface[0D], interface[1D], interface[3C], jack driver 1[2A], jack driver 1[3B], jack driver 2[2A], jack driver 2[3B], motor driver 1[3B], motor driver 2[2B], motor driver 2[3B], Power[2D], receiver 1[2A], receiver 1[2C], receiver 1[4A], receiver 1[4C], receiver 2[2A], receiver 2[2C], receiver 2[4A], receiver 2[4C]), 5v (see interface[1A], interface[1B], interface[1C], interface[2A], interface[2B], interface[2C], interface[3A], interface[3B], interface[4A], interface[4B], jack driver 1[1B], jack driver 2[1B], MCU[1A], motor driver 2[1A], Power[2C]), 12V (see jack driver 1[1B], jack driver 1[2B], jack driver 1[3B], jack driver 2[1B], jack driver 2[2C], jack driver 2[3C], motor driver 1[1A], motor driver 1[2B], motor driver 2[1A], motor driver 2[2B], motor driver 2[3B], Power[2B]), 12V (see jack driver 1[1B], jack driver 1[2B], jack driver 1[3B], jack driver 2[1B], jack driver 2[2C], jack driver 2[3C], motor driver 1[1A], motor driver 1[3B], motor driver 2[1A], motor driver 2[2B], motor driver 2[3B], Power[2B]), 12V (see jack driver 1[1B], jack driver 1[2B], jack driver 1[3B], jack driver 2[1B], jack driver 2[2C], jack driver 2[3C], motor driver 1[2B], motor driver 1[3B], motor driver 2[1A], motor driver 2[2B], motor driver 2[3B], Power[2B]), 220v (see motor driver 1[2C], motor driver 2[2C], motor driver 2[4C], Power[2A]), 220v (see motor driver 1[4C], motor driver 2[2C], motor driver 2[4C], Power[2A]), motor_close_output_1 (see MCU[1B]), motor_encoder_A_1 (see MCU[1B]), motor_encoder_B_1 (see MCU[1B]), motor_open_output_1 (see MCU[1B]), null (see motor driver 2[1A], Power[2A])

### Nets
3.3v: Q5.1(G) Q6.1(G) R16.2 R17.2 ; port 3.3v
GND: C14.1 P6.1 Q7.2(E) Q8.2(E)
5v: JP2.1 ; port 5v
12v: D4.C D5.C JP2.3 K3.4(T1) K4.4(T1) ; port 12V
Motor1_NC: J4.03 K3.3(NO)
Motor1_NO: J4.01 K4.3(NO)
MOTOR-1-ENC-A: P7.2 Q6.3(D) R15.1
MOTOR-1-ENC-B: P7.1 Q5.3(D) R14.1
power_ENC_5: JP2.2 P6.2 R14.2 R15.2
NetC14_2: C14.2 Q6.2(S) R17.1 ; port motor_encoder_A_1
NetD4_A: D4.A K3.5(T2) Q7.3(C)
NetD5_A: D5.A K4.5(T2) Q8.3(C)
NetJ1_1: J4.02 ; port null
NetJ1_2: K3.1(COM) K4.1(COM) ; port 220v
NetQ5_2: Q5.2(S) R16.1 ; port motor_encoder_B_1
NetQ7_1: Q7.1(B) R18.1
NetQ8_1: Q8.1(B) R19.1
NetR18_2: R18.2 ; port motor_close_output_1
NetR19_2: R19.2 ; port motor_open_output_1

Not connected (* = marked no-connect by the designer): K3 2(NC); K4 2(NC)

### Library data of the parts
C14 = CGA5L3X8R1H105M160AB: as C4 on sheet Power; Value: *; Purchase-URL: https://pricing.snapeda.com/search/part/CGA5L3X8R1H105M160AB/?ref=eda; Package: 3216 TDK; Availability: In Stock; SnapEDA_Link: https://www.snapeda.com/parts/CGA5L3X8R1H105M160AB/TDK/view-part/?ref=snap; MP: CGA5L3X8R1H105M160AB; Check_prices: https://www.snapeda.com/parts/CGA5L3X8R1H105M160AB/TDK/view-part/?ref=eda; Price: None
D4 D5 = SMAJ26A: 400W, 30.4V, 5%, Unidirectional, TVS; MF: Taiwan Semiconductor; SnapEDA_Link: https://www.snapeda.com/parts/SMAJ26A/taiwan/view-part/?ref=snap; Package: SMA-2 Taiwan Semiconductor; Value: *; MP: SMAJ26A; Check_prices: https://www.snapeda.com/parts/SMAJ26A/taiwan/view-part/?ref=eda
J4 = 1759020: Pluggable Header 5.08mm 12AWG 320V 12A 3 Position COMBICON MSTB Series | Phoenix Contact 1759020; SnapEDA_Link: https://www.snapeda.com/parts/1759020/Phoenix+Contact/view-part/?ref=snap; Package: None; Value: *; MF: Phoenix Contact; MP: 1759020; Check_prices: https://www.snapeda.com/parts/1759020/Phoenix+Contact/view-part/?ref=eda
JP2 = HDRLP_F_1X3: CONN, HEADER, Male, pitch: 2.54mm, 3POS; VALUE: HDRF3
K3 K4 = RELAY_SPDT_5_1512_G8QN: Relay, SPDT, 5P, 15.4X12.1mm, 16V/30A; MANF: OMRON; MANF_P#: G8QN-1C4 DC12; PARAM2: 16VDC, 30A; PARAM: 12V, 50mA; PRICE: PRICE; Value: RELAY_SPDT
P6 P7 = 1803578: as P1 on sheet Power; Price: None; Purchase-URL: https://pricing.snapeda.com/search/part/1803578/?ref=eda; Availability: Good; SnapEDA_Link: https://www.snapeda.com/parts/1803578/Phoenix%20Contact/view-part/46882/?ref=snap; MP: 1803578; Value: *; Check_prices: https://www.snapeda.com/parts/1803578/Phoenix%20Contact/view-part/46882/?ref=eda; Package: Custom Package Phoenix Contact
Q5 Q6 = 2N7002: N-Channel 60V 280mA (Ta) 350mW (Ta) Surface Mount SOT-23-3 (TO-236); MF: {'manufacturer': u'onsemi'}; Package: None; Price: None; Value: *; MP: 2N7002; Availability: Unavailable
Q7 Q8 = SS8050-G: Bipolar (BJT) Transistor NPN 25 V 1.5 A 100MHz 300 mW Surface Mount SOT-23-3; MP: SS8050G; MF: Comchip; Digi-Key_Part_Number: 641-1790-2-ND; Check_prices: https://www.snapeda.com/parts/SS8050G/Comchip/view-part/?ref=eda; Package: None; SnapEDA_Link: https://www.snapeda.com/parts/SS8050G/Comchip/view-part/?ref=snap; Value: *
R14-R19 = CPF1206B10KE1: as R1 on sheet Power; SnapEDA_Link: https://www.snapeda.com/parts/CPF1206B10KE1/TE+Connectivity/view-part/?ref=snap; Package: 1206; Resistance: 10K; Value: *; MP: CPF1206B10KE1; EU_RoHS_Compliance: Compliant; Check_prices: https://www.snapeda.com/parts/CPF1206B10KE1/TE+Connectivity/view-part/?ref=eda

## Sheet motor driver 2.SchDoc
size A4; SheetNumber: 6; SheetTotal: 9
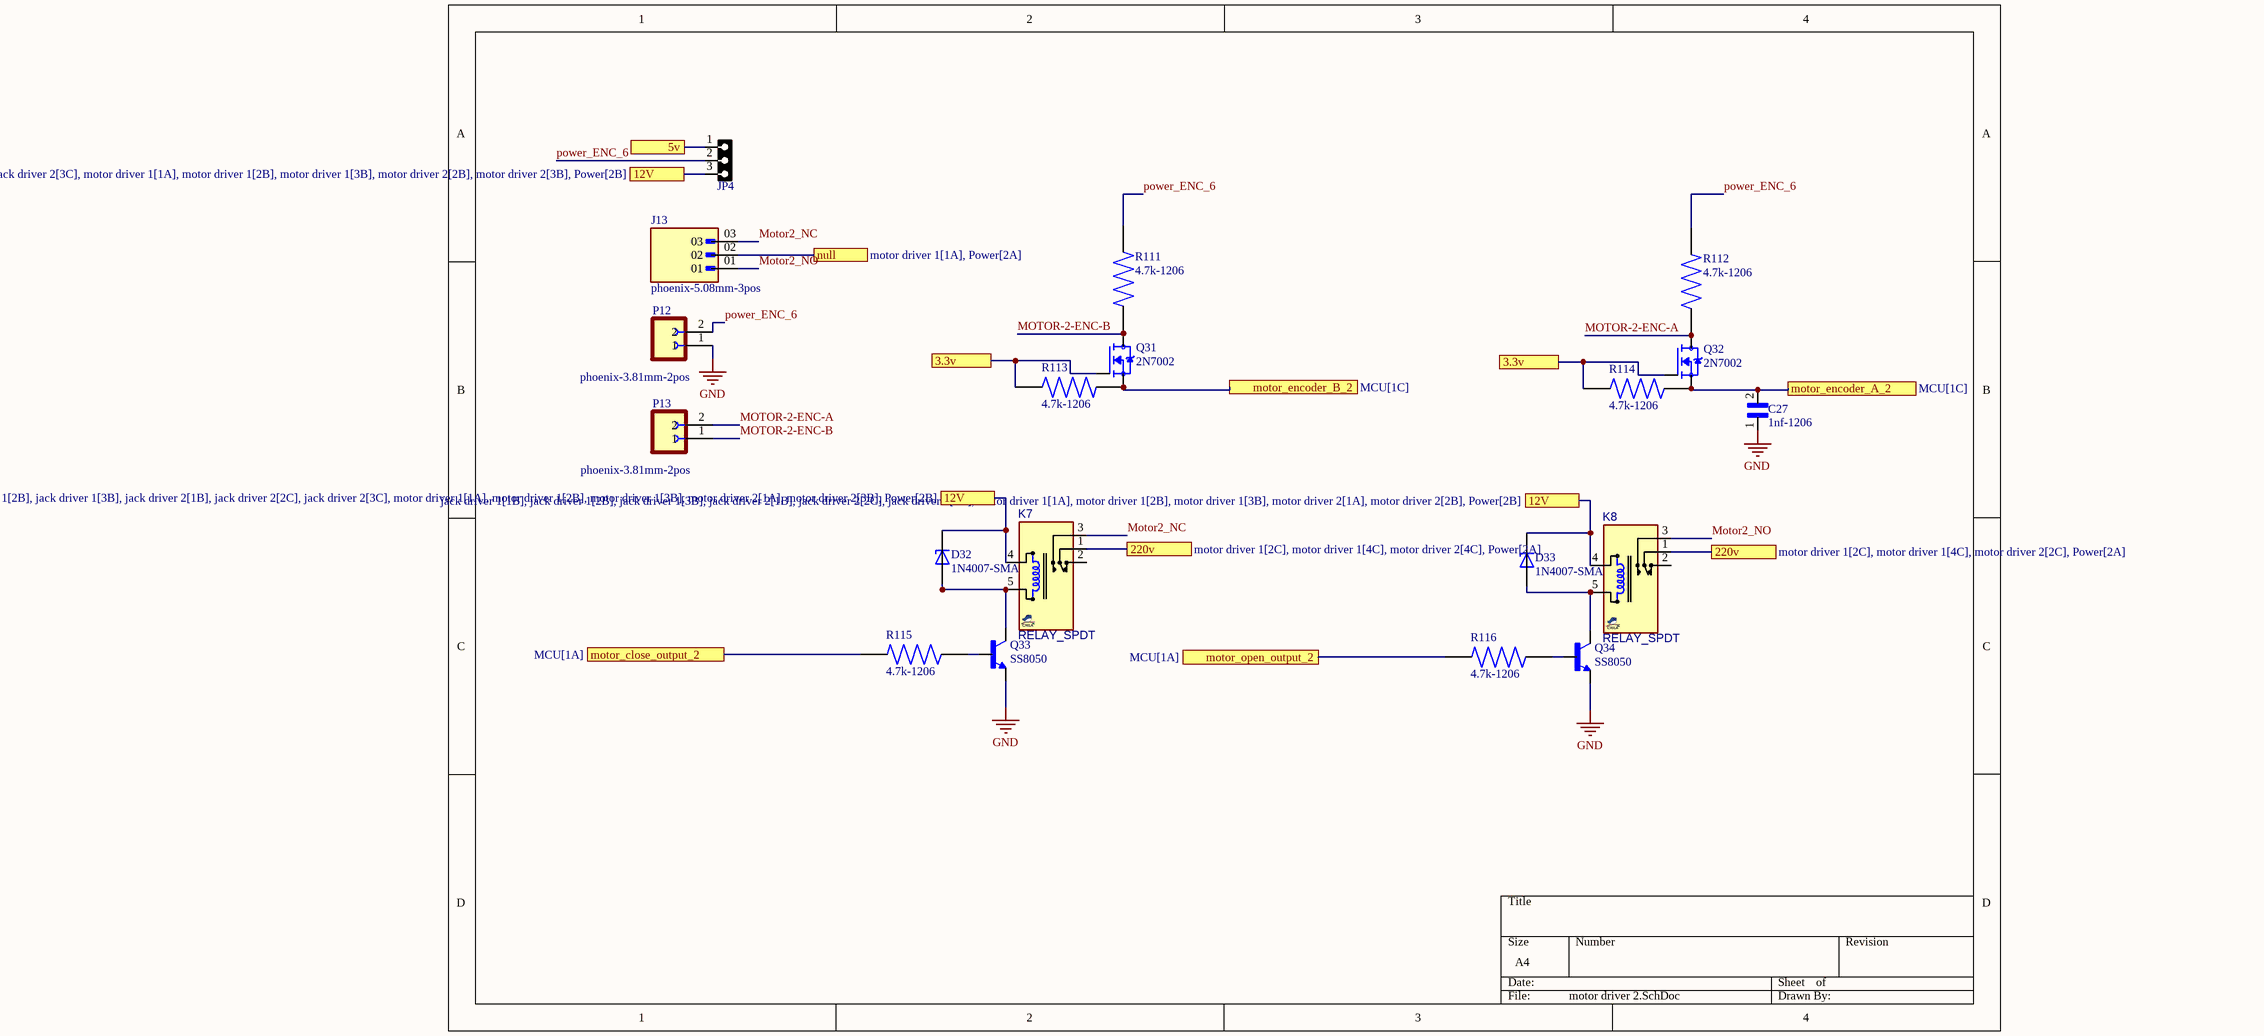
[diagram p5: motor driver 2.SchDoc]

### Parts
C27  1nf-1206  [CAPC3216X180N]
D32  1N4007-SMA  [DIOM4325X250N]
D33  1N4007-SMA  [DIOM4325X250N]
J13  phoenix-5.08mm-3pos  [PHOENIX_1759020]
JP4  HDRF3  [HDRLP_F_1X3]  (value not drawn)
K7  RELAY_SPDT  [REL_SPDT_5_1512]
K8  RELAY_SPDT  [REL_SPDT_5_1512]
P12  phoenix-3.81mm-2pos  [PHOENIX_1803578]
P13  phoenix-3.81mm-2pos  [PHOENIX_1803578]
Q31  2N7002  [SOT95P240X111-3N]
Q32  2N7002  [SOT95P240X111-3N]
Q33  SS8050  [TRANS_SS8050-G]
Q34  SS8050  [TRANS_SS8050-G]
R111  4.7k-1206  [RESC3015X65N]
R112  4.7k-1206  [RESC3015X65N]
R113  4.7k-1206  [RESC3015X65N]
R114  4.7k-1206  [RESC3015X65N]
R115  4.7k-1206  [RESC3015X65N]
R116  4.7k-1206  [RESC3015X65N]

### Ports
3.3v (see interface[1D], interface[2D], interface[3C], jack driver 1[2A], jack driver 1[3B], jack driver 2[2A], jack driver 2[3B], motor driver 1[2B], motor driver 1[3B], motor driver 2[2B], Power[2D], receiver 1[2A], receiver 1[2C], receiver 1[4A], receiver 1[4C], receiver 2[2A], receiver 2[2C], receiver 2[4A], receiver 2[4C]), 3.3v (see interface[1D], interface[2D], interface[3C], jack driver 1[2A], jack driver 1[3B], jack driver 2[2A], jack driver 2[3B], motor driver 1[2B], motor driver 1[3B], motor driver 2[3B], Power[2D], receiver 1[2A], receiver 1[2C], receiver 1[4A], receiver 1[4C], receiver 2[2A], receiver 2[2C], receiver 2[4A], receiver 2[4C]), 5v (see interface[1A], interface[1B], interface[1C], interface[2A], interface[2B], interface[2C], interface[3A], interface[3B], interface[4A], interface[4B], jack driver 1[1B], jack driver 2[1B], MCU[1A], motor driver 1[1A], Power[2C]), 12V (see jack driver 1[1B], jack driver 1[2B], jack driver 1[3B], jack driver 2[1B], jack driver 2[2C], jack driver 2[3C], motor driver 1[1A], motor driver 1[2B], motor driver 1[3B], motor driver 2[1A], motor driver 2[2B], Power[2B]), 12V (see jack driver 1[1B], jack driver 1[2B], jack driver 1[3B], jack driver 2[1B], jack driver 2[2C], jack driver 2[3C], motor driver 1[1A], motor driver 1[2B], motor driver 1[3B], motor driver 2[1A], motor driver 2[3B], Power[2B]), 12V (see jack driver 1[1B], jack driver 1[2B], jack driver 1[3B], jack driver 2[1B], jack driver 2[2C], jack driver 2[3C], motor driver 1[1A], motor driver 1[2B], motor driver 1[3B], motor driver 2[2B], motor driver 2[3B], Power[2B]), 220v (see motor driver 1[2C], motor driver 1[4C], motor driver 2[2C], Power[2A]), 220v (see motor driver 1[2C], motor driver 1[4C], motor driver 2[4C], Power[2A]), motor_close_output_2 (see MCU[1A]), motor_encoder_A_2 (see MCU[1C]), motor_encoder_B_2 (see MCU[1C]), motor_open_output_2 (see MCU[1A]), null (see motor driver 1[1A], Power[2A])

### Nets
3.3v: Q31.1(G) Q32.1(G) R113.2 R114.2 ; port 3.3v
GND: C27.1 P12.1 Q33.2(E) Q34.2(E)
5v: JP4.1 ; port 5v
12v: D32.C D33.C JP4.3 K7.4(T1) K8.4(T1) ; port 12V
Motor2_NC: J13.03 K7.3(NO)
Motor2_NO: J13.01 K8.3(NO)
MOTOR-2-ENC-A: P13.2 Q32.3(D) R112.1
MOTOR-2-ENC-B: P13.1 Q31.3(D) R111.1
power_ENC_6: JP4.2 P12.2 R111.2 R112.2
NetC27_2: C27.2 Q32.2(S) R114.1 ; port motor_encoder_A_2
NetD32_A: D32.A K7.5(T2) Q33.3(C)
NetD33_A: D33.A K8.5(T2) Q34.3(C)
NetJ1_1: J13.02 ; port null
NetJ1_2: K7.1(COM) K8.1(COM) ; port 220v
NetQ31_2: Q31.2(S) R113.1 ; port motor_encoder_B_2
NetQ33_1: Q33.1(B) R115.1
NetQ34_1: Q34.1(B) R116.1
NetR115_2: R115.2 ; port motor_close_output_2
NetR116_2: R116.2 ; port motor_open_output_2

Not connected (* = marked no-connect by the designer): K7 2(NC); K8 2(NC)

### Library data of the parts
C27 = CGA5L3X8R1H105M160AB: as C4 on sheet Power; Value: *; Purchase-URL: https://pricing.snapeda.com/search/part/CGA5L3X8R1H105M160AB/?ref=eda; Package: 3216 TDK; Availability: In Stock; SnapEDA_Link: https://www.snapeda.com/parts/CGA5L3X8R1H105M160AB/TDK/view-part/?ref=snap; MP: CGA5L3X8R1H105M160AB; Check_prices: https://www.snapeda.com/parts/CGA5L3X8R1H105M160AB/TDK/view-part/?ref=eda; Price: None
D32 D33 = SMAJ26A: as D4 on sheet motor driver 1; SnapEDA_Link: https://www.snapeda.com/parts/SMAJ26A/taiwan/view-part/?ref=snap; Package: SMA-2 Taiwan Semiconductor; Value: *; MP: SMAJ26A; Check_prices: https://www.snapeda.com/parts/SMAJ26A/taiwan/view-part/?ref=eda
J13 = 1759020: as J4 on sheet motor driver 1; SnapEDA_Link: https://www.snapeda.com/parts/1759020/Phoenix+Contact/view-part/?ref=snap; Package: None; Value: *; MF: Phoenix Contact; MP: 1759020; Check_prices: https://www.snapeda.com/parts/1759020/Phoenix+Contact/view-part/?ref=eda
JP4 = HDRLP_F_1X3: CONN, HEADER, Male, pitch: 2.54mm, 3POS; VALUE: HDRF3
K7 K8 = RELAY_SPDT_5_1512_G8QN: as K3 on sheet motor driver 1; PRICE: PRICE; Value: RELAY_SPDT
P12 P13 = 1803578: as P1 on sheet Power; Price: None; Purchase-URL: https://pricing.snapeda.com/search/part/1803578/?ref=eda; Availability: Good; SnapEDA_Link: https://www.snapeda.com/parts/1803578/Phoenix%20Contact/view-part/46882/?ref=snap; MP: 1803578; Value: *; Check_prices: https://www.snapeda.com/parts/1803578/Phoenix%20Contact/view-part/46882/?ref=eda; Package: Custom Package Phoenix Contact
Q31 Q32 = 2N7002: as Q5 on sheet motor driver 1; Package: None; Price: None; Value: *; MP: 2N7002; Availability: Unavailable
Q33 Q34 = SS8050-G: as Q7 on sheet motor driver 1; Digi-Key_Part_Number: 641-1790-2-ND; Check_prices: https://www.snapeda.com/parts/SS8050G/Comchip/view-part/?ref=eda; Package: None; SnapEDA_Link: https://www.snapeda.com/parts/SS8050G/Comchip/view-part/?ref=snap; Value: *
R111-R116 = CPF1206B10KE1: as R1 on sheet Power; SnapEDA_Link: https://www.snapeda.com/parts/CPF1206B10KE1/TE+Connectivity/view-part/?ref=snap; Package: 1206; Resistance: 10K; Value: *; MP: CPF1206B10KE1; EU_RoHS_Compliance: Compliant; Check_prices: https://www.snapeda.com/parts/CPF1206B10KE1/TE+Connectivity/view-part/?ref=eda

## Sheet jack driver 1.SchDoc
size A4; SheetNumber: 7; SheetTotal: 9
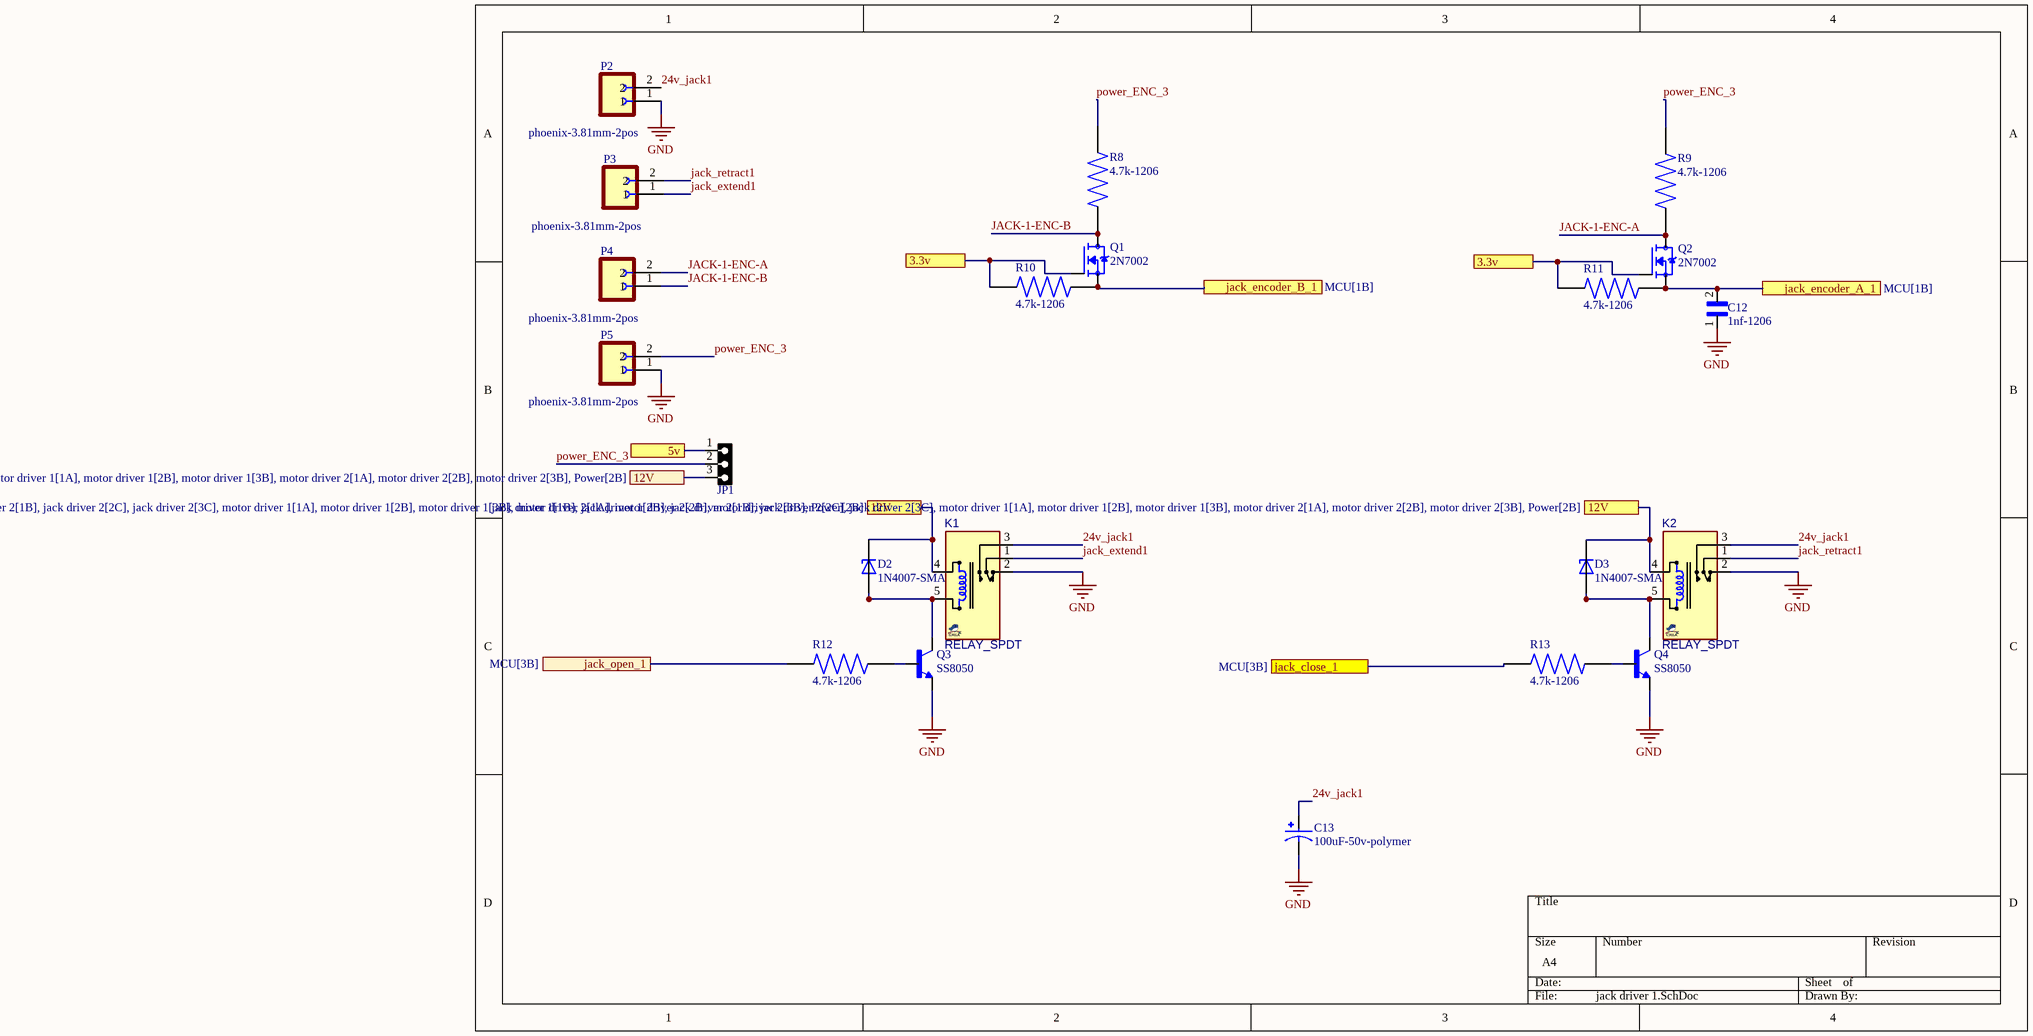
[diagram p6: jack driver 1.SchDoc]

### Parts
C12  1nf-1206  [CAPC3216X180N]
C13  100uF-50v-polymer  [CAP_EEEFN1H101L]
D2  1N4007-SMA  [DIOM4325X250N]
D3  1N4007-SMA  [DIOM4325X250N]
JP1  HDRF3  [HDRLP_F_1X3]  (value not drawn)
K1  RELAY_SPDT  [REL_SPDT_5_1512]
K2  RELAY_SPDT  [REL_SPDT_5_1512]
P2  phoenix-3.81mm-2pos  [PHOENIX_1803578]
P3  phoenix-3.81mm-2pos  [PHOENIX_1803578]
P4  phoenix-3.81mm-2pos  [PHOENIX_1803578]
P5  phoenix-3.81mm-2pos  [PHOENIX_1803578]
Q1  2N7002  [SOT95P240X111-3N]
Q2  2N7002  [SOT95P240X111-3N]
Q3  SS8050  [TRANS_SS8050-G]
Q4  SS8050  [TRANS_SS8050-G]
R8  4.7k-1206  [RESC3015X65N]
R9  4.7k-1206  [RESC3015X65N]
R10  4.7k-1206  [RESC3015X65N]
R11  4.7k-1206  [RESC3015X65N]
R12  4.7k-1206  [RESC3015X65N]
R13  4.7k-1206  [RESC3015X65N]

### Ports
3.3v (see interface[0D], interface[1D], interface[3C], jack driver 1[2A], jack driver 2[2A], jack driver 2[3B], motor driver 1[2B], motor driver 1[3B], motor driver 2[2B], motor driver 2[3B], Power[2D], receiver 1[2A], receiver 1[2C], receiver 1[4A], receiver 1[4C], receiver 2[2A], receiver 2[2C], receiver 2[4A], receiver 2[4C]), 3.3v (see interface[0D], interface[1D], interface[3C], jack driver 1[3B], jack driver 2[2A], jack driver 2[3B], motor driver 1[2B], motor driver 1[3B], motor driver 2[2B], motor driver 2[3B], Power[2D], receiver 1[2A], receiver 1[2C], receiver 1[4A], receiver 1[4C], receiver 2[2A], receiver 2[2C], receiver 2[4A], receiver 2[4C]), 5v (see interface[1A], interface[1B], interface[1C], interface[2A], interface[2B], interface[2C], interface[3A], interface[3B], interface[4A], interface[4B], jack driver 2[1B], MCU[1A], motor driver 1[1A], motor driver 2[1A], Power[2C]), 12V (see jack driver 1[1B], jack driver 1[2B], jack driver 2[1B], jack driver 2[2C], jack driver 2[3C], motor driver 1[1A], motor driver 1[2B], motor driver 1[3B], motor driver 2[1A], motor driver 2[2B], motor driver 2[3B], Power[2B]), 12V (see jack driver 1[1B], jack driver 1[3B], jack driver 2[1B], jack driver 2[2C], jack driver 2[3C], motor driver 1[1A], motor driver 1[2B], motor driver 1[3B], motor driver 2[1A], motor driver 2[2B], motor driver 2[3B], Power[2B]), 12V (see jack driver 1[2B], jack driver 1[3B], jack driver 2[1B], jack driver 2[2C], jack driver 2[3C], motor driver 1[1A], motor driver 1[2B], motor driver 1[3B], motor driver 2[1A], motor driver 2[2B], motor driver 2[3B], Power[2B]), jack_close_1 (see MCU[3B]), jack_encoder_A_1 (see MCU[1B]), jack_encoder_B_1 (see MCU[1B]), jack_open_1 (see MCU[3B])

### Nets
3.3v: Q1.1(G) Q2.1(G) R10.2 R11.2 ; port 3.3v
GND: C12.1 C13.2 K1.2(NC) K2.2(NC) P2.1 P5.1 Q3.2(E) Q4.2(E)
5v: JP1.1 ; port 5v
12v: D2.C D3.C JP1.3 K1.4(T1) K2.4(T1) ; port 12V
24v_jack1: C13.1 K1.3(NO) K2.3(NO) P2.2
JACK-1-ENC-A: P4.2 Q2.3(D) R9.1
JACK-1-ENC-B: P4.1 Q1.3(D) R8.1
jack_extend1: K1.1(COM) P3.1
jack_retract1: K2.1(COM) P3.2
power_ENC_3: JP1.2 P5.2 R8.2 R9.2
NetC12_2: C12.2 Q2.2(S) R11.1 ; port jack_encoder_A_1
NetD2_A: D2.A K1.5(T2) Q3.3(C)
NetD3_A: D3.A K2.5(T2) Q4.3(C)
NetQ1_2: Q1.2(S) R10.1 ; port jack_encoder_B_1
NetQ3_1: Q3.1(B) R12.1
NetQ4_1: Q4.1(B) R13.1
NetR12_2: R12.2 ; port jack_open_1
NetR13_2: R13.2 ; port jack_close_1

### Library data of the parts
C12 = CGA5L3X8R1H105M160AB: as C4 on sheet Power; Value: *; Purchase-URL: https://pricing.snapeda.com/search/part/CGA5L3X8R1H105M160AB/?ref=eda; Package: 3216 TDK; Availability: In Stock; SnapEDA_Link: https://www.snapeda.com/parts/CGA5L3X8R1H105M160AB/TDK/view-part/?ref=snap; MP: CGA5L3X8R1H105M160AB; Check_prices: https://www.snapeda.com/parts/CGA5L3X8R1H105M160AB/TDK/view-part/?ref=eda; Price: None
C13 = EEEFN1H101L: as C1 on sheet Power; SnapEDA_Link: https://www.snapeda.com/parts/EEEFN1H101L/Panasonic/view-part/?ref=snap; Package: RADIAL-2 Panasonic; Value: *; MP: EEEFN1H101L; Check_prices: https://www.snapeda.com/parts/EEEFN1H101L/Panasonic/view-part/?ref=eda
D2 D3 = SMAJ26A: as D4 on sheet motor driver 1; SnapEDA_Link: https://www.snapeda.com/parts/SMAJ26A/taiwan/view-part/?ref=snap; Package: SMA-2 Taiwan Semiconductor; Value: *; MP: SMAJ26A; Check_prices: https://www.snapeda.com/parts/SMAJ26A/taiwan/view-part/?ref=eda
JP1 = HDRLP_F_1X3: CONN, HEADER, Male, pitch: 2.54mm, 3POS; VALUE: HDRF3
K1 K2 = RELAY_SPDT_5_1512_G8QN: as K3 on sheet motor driver 1; PRICE: PRICE; Value: RELAY_SPDT
P2-P5 = 1803578: as P1 on sheet Power; Price: None; Purchase-URL: https://pricing.snapeda.com/search/part/1803578/?ref=eda; Availability: Good; SnapEDA_Link: https://www.snapeda.com/parts/1803578/Phoenix%20Contact/view-part/46882/?ref=snap; MP: 1803578; Value: *; Check_prices: https://www.snapeda.com/parts/1803578/Phoenix%20Contact/view-part/46882/?ref=eda; Package: Custom Package Phoenix Contact
Q1 Q2 = 2N7002: as Q5 on sheet motor driver 1; Package: None; Price: None; Value: *; MP: 2N7002; Availability: Unavailable
Q3 Q4 = SS8050-G: as Q7 on sheet motor driver 1; Digi-Key_Part_Number: 641-1790-2-ND; Check_prices: https://www.snapeda.com/parts/SS8050G/Comchip/view-part/?ref=eda; Package: None; SnapEDA_Link: https://www.snapeda.com/parts/SS8050G/Comchip/view-part/?ref=snap; Value: *
R8-R13 = CPF1206B10KE1: as R1 on sheet Power; SnapEDA_Link: https://www.snapeda.com/parts/CPF1206B10KE1/TE+Connectivity/view-part/?ref=snap; Package: 1206; Resistance: 10K; Value: *; MP: CPF1206B10KE1; EU_RoHS_Compliance: Compliant; Check_prices: https://www.snapeda.com/parts/CPF1206B10KE1/TE+Connectivity/view-part/?ref=eda

## Sheet jack driver 2.SchDoc
size A4; SheetNumber: 8; SheetTotal: 9
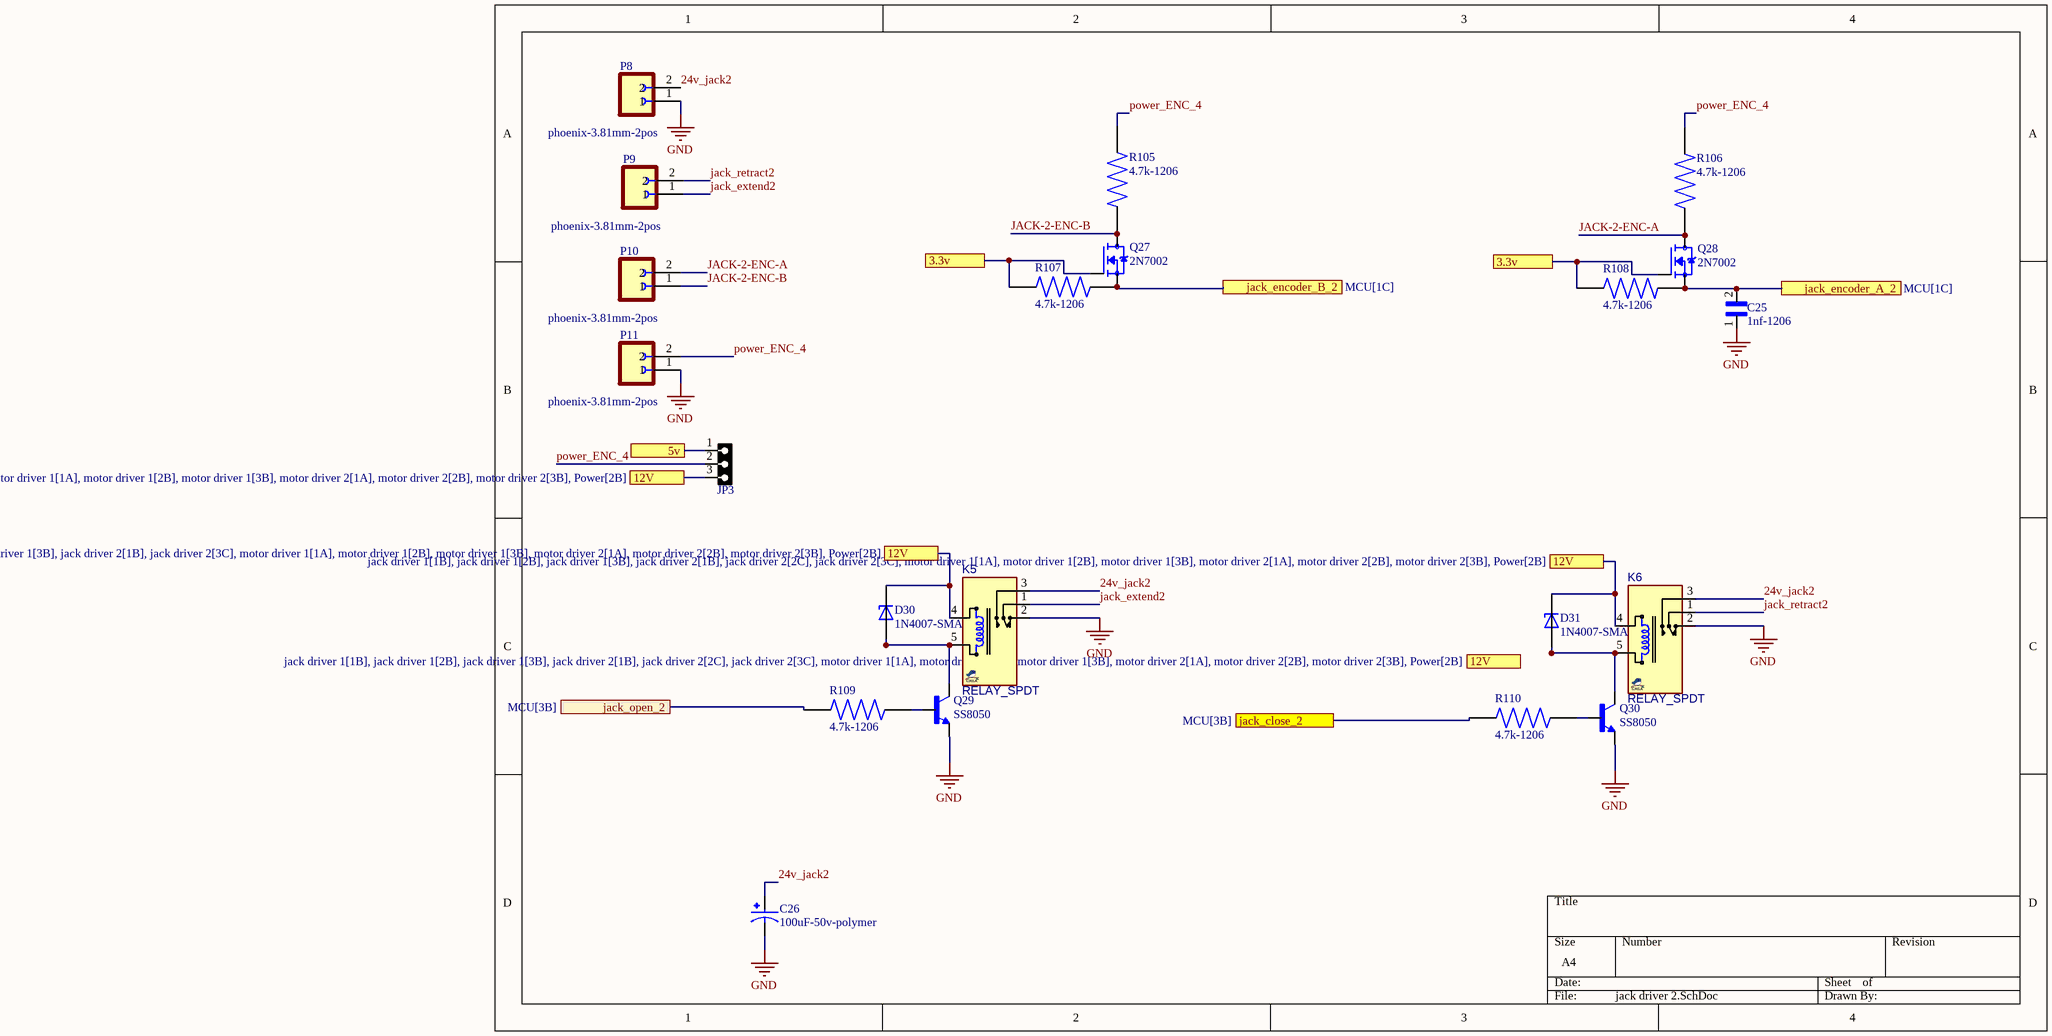
[diagram p7: jack driver 2.SchDoc]

### Parts
C25  1nf-1206  [CAPC3216X180N]
C26  100uF-50v-polymer  [CAP_EEEFN1H101L]
D30  1N4007-SMA  [DIOM4325X250N]
D31  1N4007-SMA  [DIOM4325X250N]
JP3  HDRF3  [HDRLP_F_1X3]  (value not drawn)
K5  RELAY_SPDT  [REL_SPDT_5_1512]
K6  RELAY_SPDT  [REL_SPDT_5_1512]
P8  phoenix-3.81mm-2pos  [PHOENIX_1803578]
P9  phoenix-3.81mm-2pos  [PHOENIX_1803578]
P10  phoenix-3.81mm-2pos  [PHOENIX_1803578]
P11  phoenix-3.81mm-2pos  [PHOENIX_1803578]
Q27  2N7002  [SOT95P240X111-3N]
Q28  2N7002  [SOT95P240X111-3N]
Q29  SS8050  [TRANS_SS8050-G]
Q30  SS8050  [TRANS_SS8050-G]
R105  4.7k-1206  [RESC3015X65N]
R106  4.7k-1206  [RESC3015X65N]
R107  4.7k-1206  [RESC3015X65N]
R108  4.7k-1206  [RESC3015X65N]
R109  4.7k-1206  [RESC3015X65N]
R110  4.7k-1206  [RESC3015X65N]

### Ports
3.3v (see interface[0D], interface[1D], interface[3C], jack driver 1[2A], jack driver 1[3B], jack driver 2[2A], motor driver 1[2B], motor driver 1[3B], motor driver 2[2B], motor driver 2[3B], Power[2D], receiver 1[2A], receiver 1[2C], receiver 1[4A], receiver 1[4C], receiver 2[2A], receiver 2[2C], receiver 2[4A], receiver 2[4C]), 3.3v (see interface[0D], interface[1D], interface[3C], jack driver 1[2A], jack driver 1[3B], jack driver 2[3B], motor driver 1[2B], motor driver 1[3B], motor driver 2[2B], motor driver 2[3B], Power[2D], receiver 1[2A], receiver 1[2C], receiver 1[4A], receiver 1[4C], receiver 2[2A], receiver 2[2C], receiver 2[4A], receiver 2[4C]), 5v (see interface[1A], interface[1B], interface[1C], interface[2A], interface[2B], interface[2C], interface[3A], interface[3B], interface[4A], interface[4B], jack driver 1[1B], MCU[1A], motor driver 1[1A], motor driver 2[1A], Power[2C]), 12V (see jack driver 1[1B], jack driver 1[2B], jack driver 1[3B], jack driver 2[1B], jack driver 2[2C], jack driver 2[3C], motor driver 1[1A], motor driver 1[2B], motor driver 1[3B], motor driver 2[1A], motor driver 2[2B], motor driver 2[3B], Power[2B]), 12V (see jack driver 1[1B], jack driver 1[2B], jack driver 1[3B], jack driver 2[1B], jack driver 2[3C], motor driver 1[1A], motor driver 1[2B], motor driver 1[3B], motor driver 2[1A], motor driver 2[2B], motor driver 2[3B], Power[2B]), 12V (see jack driver 1[1B], jack driver 1[2B], jack driver 1[3B], jack driver 2[2C], jack driver 2[3C], motor driver 1[1A], motor driver 1[2B], motor driver 1[3B], motor driver 2[1A], motor driver 2[2B], motor driver 2[3B], Power[2B]), jack_close_2 (see MCU[3B]), jack_encoder_A_2 (see MCU[1C]), jack_encoder_B_2 (see MCU[1C]), jack_open_2 (see MCU[3B])

### Nets
3.3v: Q27.1(G) Q28.1(G) R107.2 R108.2 ; port 3.3v
GND: C25.1 C26.2 K5.2(NC) K6.2(NC) P8.1 P11.1 Q29.2(E) Q30.2(E)
5v: JP3.1 ; port 5v
12v: D30.C D31.C JP3.3 K5.4(T1) K6.4(T1) ; port 12V
24v_jack2: C26.1 K5.3(NO) K6.3(NO) P8.2
JACK-2-ENC-A: P10.2 Q28.3(D) R106.1
JACK-2-ENC-B: P10.1 Q27.3(D) R105.1
jack_extend2: K5.1(COM) P9.1
jack_retract2: K6.1(COM) P9.2
power_ENC_4: JP3.2 P11.2 R105.2 R106.2
NetC25_2: C25.2 Q28.2(S) R108.1 ; port jack_encoder_A_2
NetD30_A: D30.A K5.5(T2) Q29.3(C)
NetD31_A: D31.A K6.5(T2) Q30.3(C)
NetQ27_2: Q27.2(S) R107.1 ; port jack_encoder_B_2
NetQ29_1: Q29.1(B) R109.1
NetQ30_1: Q30.1(B) R110.1
NetR109_2: R109.2 ; port jack_open_2
NetR110_2: R110.2 ; port jack_close_2

### Library data of the parts
C25 = CGA5L3X8R1H105M160AB: as C4 on sheet Power; Value: *; Purchase-URL: https://pricing.snapeda.com/search/part/CGA5L3X8R1H105M160AB/?ref=eda; Package: 3216 TDK; Availability: In Stock; SnapEDA_Link: https://www.snapeda.com/parts/CGA5L3X8R1H105M160AB/TDK/view-part/?ref=snap; MP: CGA5L3X8R1H105M160AB; Check_prices: https://www.snapeda.com/parts/CGA5L3X8R1H105M160AB/TDK/view-part/?ref=eda; Price: None
C26 = EEEFN1H101L: as C1 on sheet Power; SnapEDA_Link: https://www.snapeda.com/parts/EEEFN1H101L/Panasonic/view-part/?ref=snap; Package: RADIAL-2 Panasonic; Value: *; MP: EEEFN1H101L; Check_prices: https://www.snapeda.com/parts/EEEFN1H101L/Panasonic/view-part/?ref=eda
D30 D31 = SMAJ26A: as D4 on sheet motor driver 1; SnapEDA_Link: https://www.snapeda.com/parts/SMAJ26A/taiwan/view-part/?ref=snap; Package: SMA-2 Taiwan Semiconductor; Value: *; MP: SMAJ26A; Check_prices: https://www.snapeda.com/parts/SMAJ26A/taiwan/view-part/?ref=eda
JP3 = HDRLP_F_1X3: CONN, HEADER, Male, pitch: 2.54mm, 3POS; VALUE: HDRF3
K5 K6 = RELAY_SPDT_5_1512_G8QN: as K3 on sheet motor driver 1; PRICE: PRICE; Value: RELAY_SPDT
P8-P11 = 1803578: as P1 on sheet Power; Price: None; Purchase-URL: https://pricing.snapeda.com/search/part/1803578/?ref=eda; Availability: Good; SnapEDA_Link: https://www.snapeda.com/parts/1803578/Phoenix%20Contact/view-part/46882/?ref=snap; MP: 1803578; Value: *; Check_prices: https://www.snapeda.com/parts/1803578/Phoenix%20Contact/view-part/46882/?ref=eda; Package: Custom Package Phoenix Contact
Q27 Q28 = 2N7002: as Q5 on sheet motor driver 1; Package: None; Price: None; Value: *; MP: 2N7002; Availability: Unavailable
Q29 Q30 = SS8050-G: as Q7 on sheet motor driver 1; Digi-Key_Part_Number: 641-1790-2-ND; Check_prices: https://www.snapeda.com/parts/SS8050G/Comchip/view-part/?ref=eda; Package: None; SnapEDA_Link: https://www.snapeda.com/parts/SS8050G/Comchip/view-part/?ref=snap; Value: *
R105-R110 = CPF1206B10KE1: as R1 on sheet Power; SnapEDA_Link: https://www.snapeda.com/parts/CPF1206B10KE1/TE+Connectivity/view-part/?ref=snap; Package: 1206; Resistance: 10K; Value: *; MP: CPF1206B10KE1; EU_RoHS_Compliance: Compliant; Check_prices: https://www.snapeda.com/parts/CPF1206B10KE1/TE+Connectivity/view-part/?ref=eda